# Altium project BAS_DevKITV3.PrjPcb (part 1 of 2)
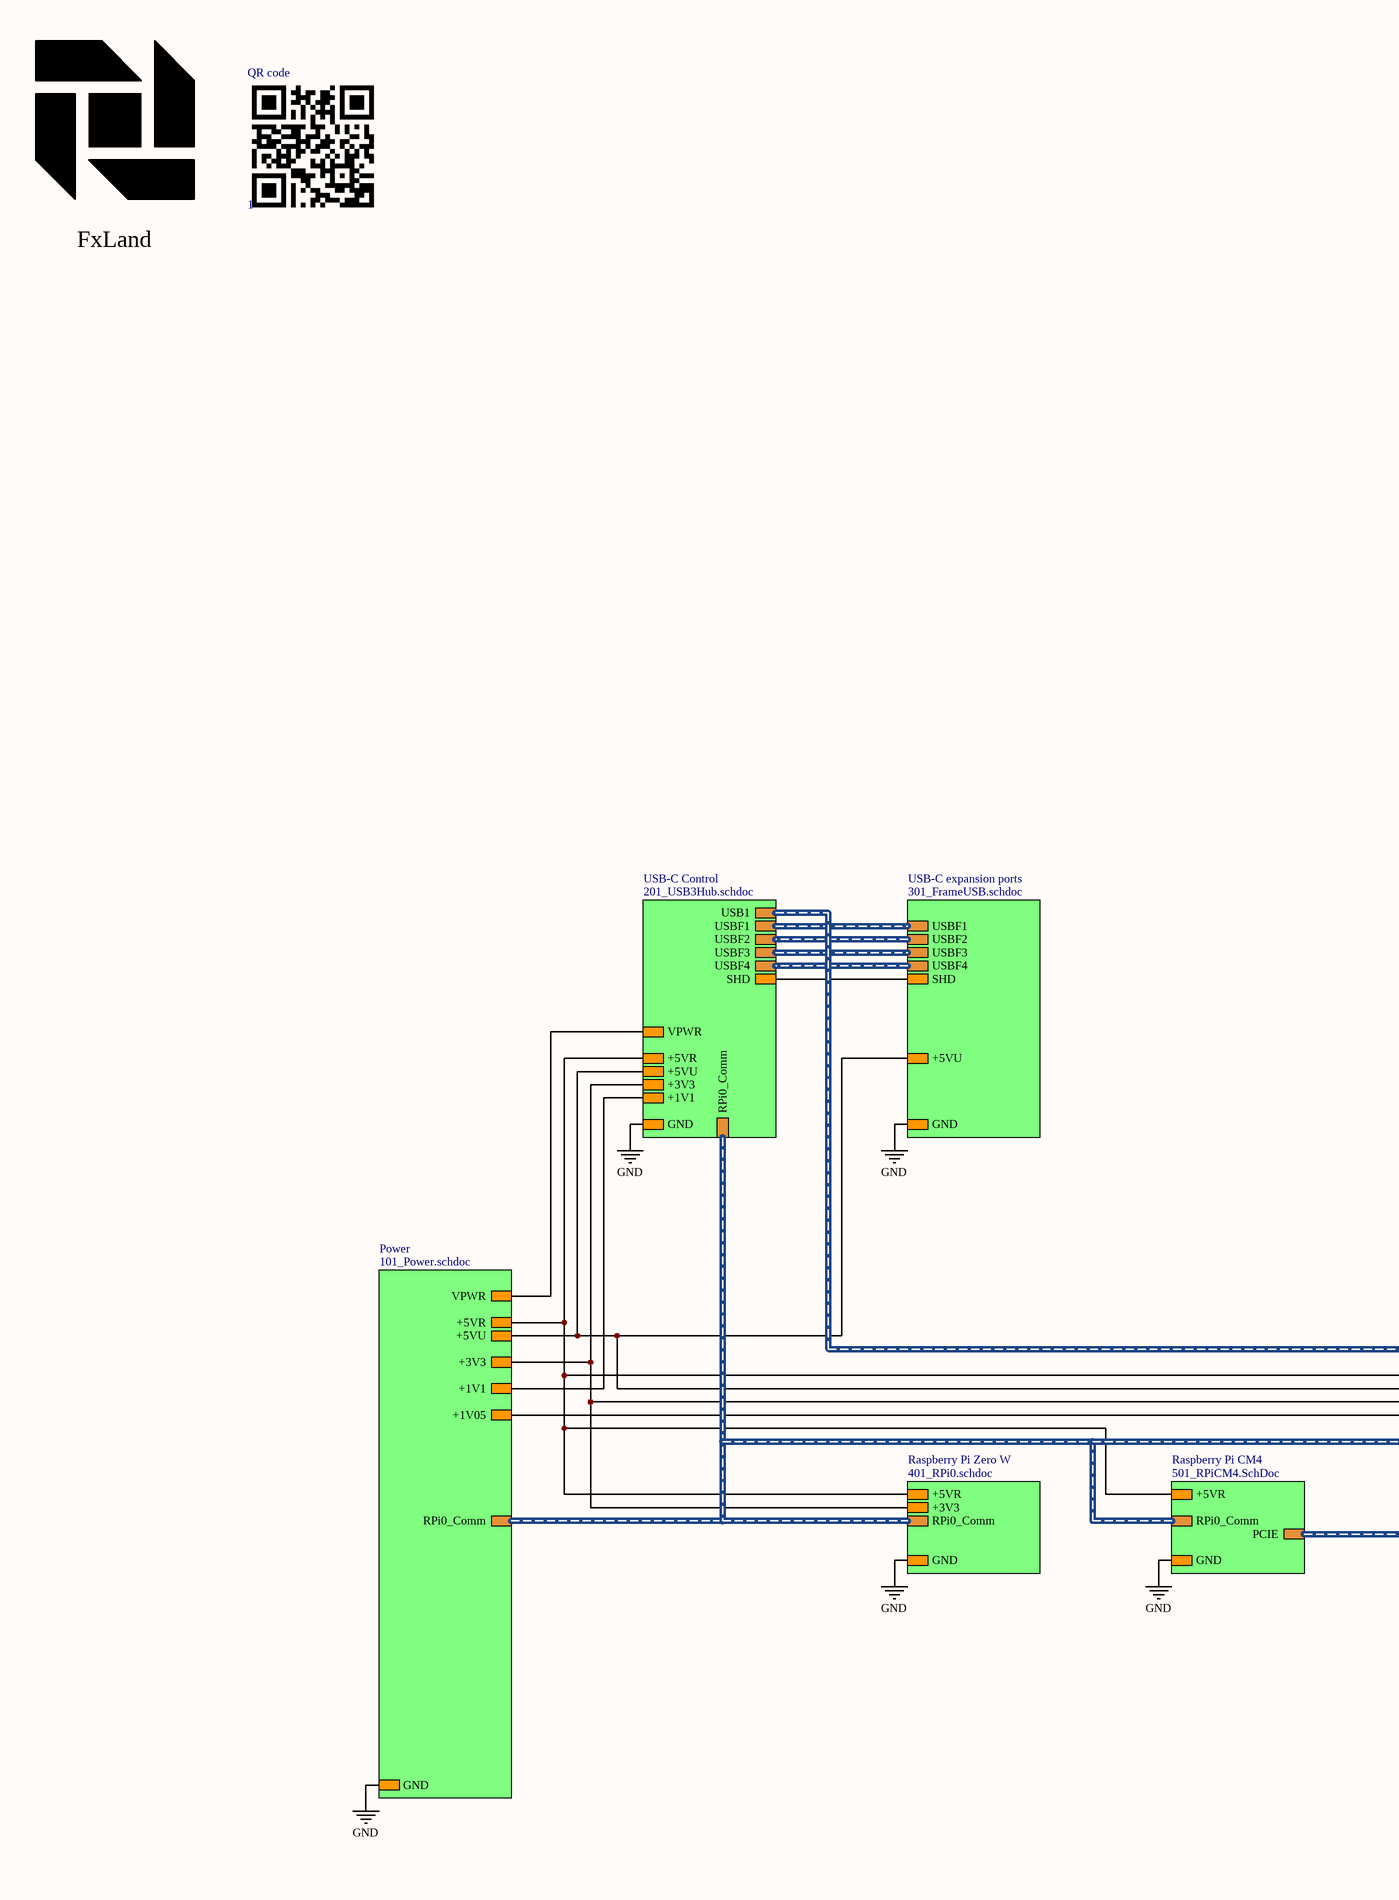
[diagram p0: 001_OverViewDevKIT.SchDoc, left]
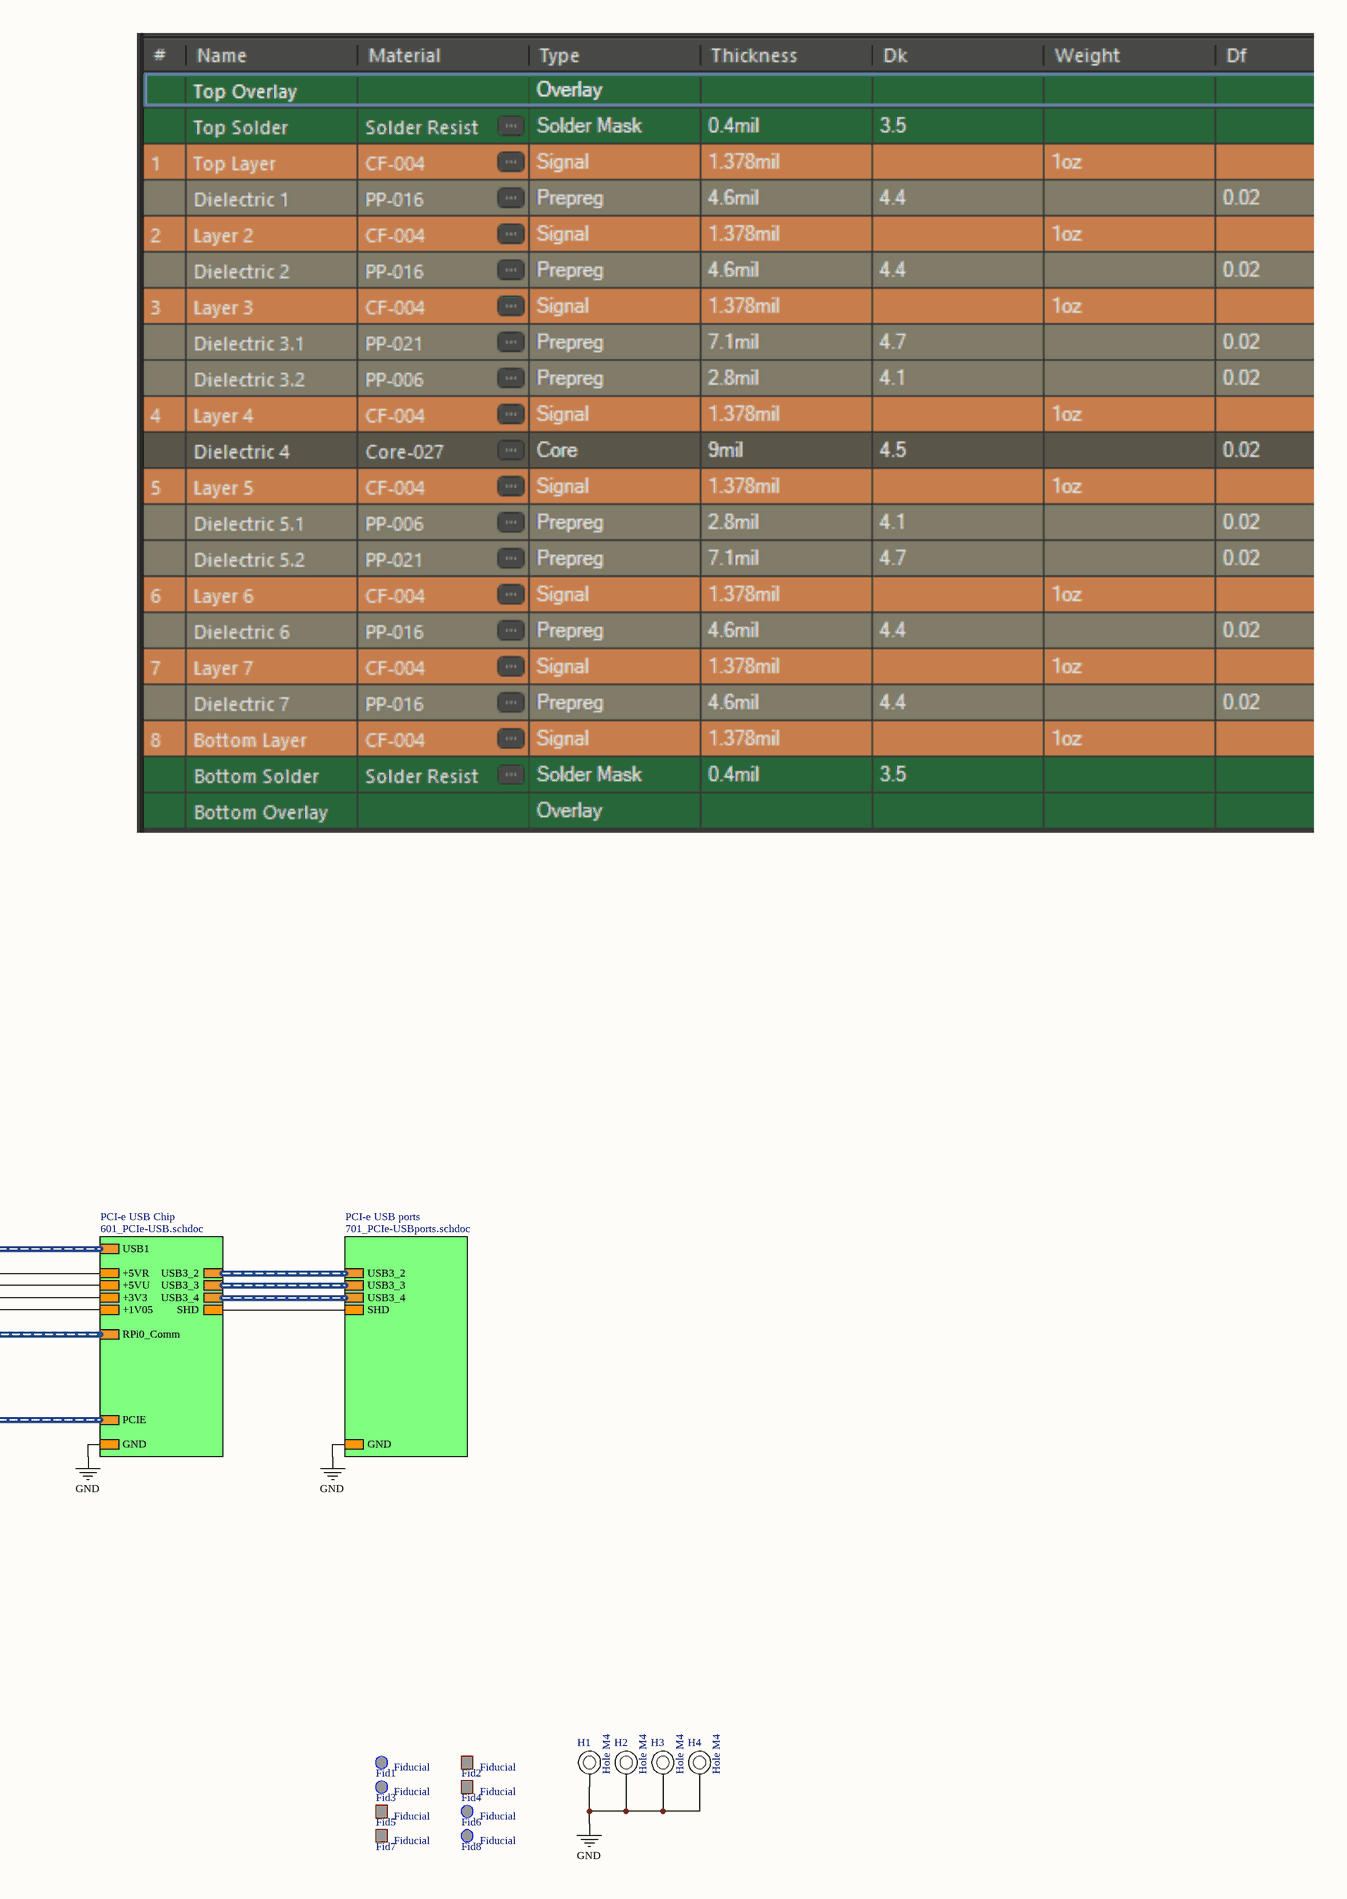
[diagram p1: 001_OverViewDevKIT.SchDoc, right]
Rev: 3.0; DocNumber: P234
8 sheets, 438 parts. Net scope: strictly hierarchical (ports join the sheet entries above them; power ports are local).
Board file: DevKITV3.PcbDoc
Sheets:
  001_OverViewDevKIT.SchDoc
    Power = 101_Power.SchDoc
    USB-C expansion ports = 301_FrameUSB.SchDoc
    Raspberry Pi Zero W = 401_RPi0.SchDoc
    Raspberry Pi CM4 = 501_RPiCM4.SchDoc
    USB-C Control = 201_USB3Hub.SchDoc
    PCI-e USB Chip = 601_PCIe-USB.SchDoc
    PCI-e USB ports = 701_PCIe-USBports.SchDoc

## Sheet 001_OverViewDevKIT.SchDoc: OverView BAS DevKIT
size A2; Organization: Greenfield Tech Solutions; Address1: Molendreef 33; Address2: Ossendrecht; Address3: 4641CS; Address4: The Netherlands; DocumentNumber: P234; Revision: 3.0; SheetNumber: 1; SheetTotal: 8

### Parts
1  QR code  [QR_FXLAND_1]
Fid1  Fiducial  [FidR_1.0mm]
Fid2  Fiducial  [FidS_1.0mm]
Fid3  Fiducial  [FidR_1.0mm]
Fid4  Fiducial  [FidS_1.0mm]
Fid5  Fiducial  [FidS_1.0mm]
Fid6  Fiducial  [FidR_1.0mm]
Fid7  Fiducial  [FidS_1.0mm]
Fid8  Fiducial  [FidR_1.0mm]
H1  Hole M4  [HOLE_M4]
H2  Hole M4  [HOLE_M4]
H3  Hole M4  [HOLE_M4]
H4  Hole M4  [HOLE_M4]
Logo_FxLand1  FxLand  [Logo_FxLand_3]  (value not drawn)

### Sub-sheets
PCI-e USB Chip = 601_PCIe-USB.schdoc: GND, SHD, PCIE (harness HF0), USB1 (harness HF0), +1V05, +3V3, USB3_2 (harness HF1), USB3_3 (harness HF2), USB3_4 (harness HF2), +5VR, +5VU, RPi0_Comm (harness CU1)
PCI-e USB ports = 701_PCIe-USBports.schdoc: GND, SHD, USB3_2 (harness HF1), USB3_3 (harness HF2), USB3_4 (harness HF2)
Power = 101_Power.schdoc: GND, VPWR, +3V3, +1V05, +5VR, RPi0_Comm (harness CU1), +5VU, +1V1
Raspberry Pi CM4 = 501_RPiCM4.SchDoc: GND, +5VR, PCIE (harness HF0), RPi0_Comm (harness CU1)
Raspberry Pi Zero W = 401_RPi0.schdoc: GND, +5VR, +3V3, RPi0_Comm (harness CU1)
USB-C Control = 201_USB3Hub.schdoc: GND, VPWR, +5VR, +3V3, +1V1, SHD, RPi0_Comm (harness CU1), USBF2 (harness HF0), USBF3 (harness HF1), USBF4 (harness HF2), USB1 (harness HF0), USBF1 (harness HF0), +5VU
USB-C expansion ports = 301_FrameUSB.schdoc: GND, +5VU, SHD, USBF2 (harness HF0), USBF3 (harness HF1), USBF4 (harness HF2), USBF1 (harness HF0)

### Nets
+1V1: sheet Power/+1V1, sheet USB-C Control/+1V1
+1V05: sheet Power/+1V05, sheet PCI-e USB Chip/+1V05
+3V3: sheet Power/+3V3, sheet Raspberry Pi Zero W/+3V3, sheet USB-C Control/+3V3, sheet PCI-e USB Chip/+3V3
+5VR: sheet Power/+5VR, sheet Raspberry Pi Zero W/+5VR, sheet Raspberry Pi CM4/+5VR, sheet USB-C Control/+5VR, sheet PCI-e USB Chip/+5VR
+5VU: sheet Power/+5VU, sheet USB-C expansion ports/+5VU, sheet USB-C Control/+5VU, sheet PCI-e USB Chip/+5VU
GND: H1.1 H2.1 H3.1 H4.1 ; sheet Power/GND, sheet USB-C expansion ports/GND, sheet USB-C expansion ports/SHD, sheet Raspberry Pi Zero W/GND, sheet Raspberry Pi CM4/GND, sheet USB-C Control/GND, sheet USB-C Control/SHD, sheet PCI-e USB Chip/GND, sheet PCI-e USB Chip/SHD, sheet PCI-e USB ports/GND, sheet PCI-e USB ports/SHD
VPWR: sheet Power/VPWR, sheet USB-C Control/VPWR

### Buses and harness runs
harness sheet PCI-e USB Chip/PCIE = sheet Raspberry Pi CM4/PCIE
harness sheet PCI-e USB Chip/RPi0_Comm = sheet Power/RPi0_Comm = sheet Raspberry Pi CM4/RPi0_Comm = sheet Raspberry Pi Zero W/RPi0_Comm = sheet USB-C Control/RPi0_Comm
harness sheet PCI-e USB Chip/USB1 = sheet USB-C Control/USB1
harness sheet PCI-e USB Chip/USB3_2 = sheet PCI-e USB ports/USB3_2
harness sheet PCI-e USB Chip/USB3_3 = sheet PCI-e USB ports/USB3_3
harness sheet PCI-e USB Chip/USB3_4 = sheet PCI-e USB ports/USB3_4
harness sheet USB-C Control/USBF1 = sheet USB-C expansion ports/USBF1
harness sheet USB-C Control/USBF2 = sheet USB-C expansion ports/USBF2
harness sheet USB-C Control/USBF3 = sheet USB-C expansion ports/USBF3
harness sheet USB-C Control/USBF4 = sheet USB-C expansion ports/USBF4

### Notes on the sheet
- Title
- Size:
- Date:
- File:
- A2
- Number:
- Time:
- Revision:
- Sheet
- of

### Library data of the parts
1 = ME0023: QR code FxLand 1; Part Number: ME0023; ID: 23; RefVal: QR code
Fid1 Fid3 Fid6 Fid8 = ME0011: Fiducial Round 1mm; Part Number: ME0011; ID: 11; RefVal: Fiducial
Fid2 Fid4 Fid5 Fid7 = ME0012: Fiducial Sqaure 1mm; Part Number: ME0012; ID: 12; RefVal: Fiducial
H1-H4 = ME0002: Mounting Hole M4; Part Number: ME0002; ID: 2; RefVal: Hole M4
Logo_FxLand1 = ME0008: Logo FxLand 3; Part Number: ME0008; ID: 8; RefVal: FxLand

## Sheet 101_Power.SchDoc: Power DevKIT
size A2; Organization: Greenfield Tech Solutions; Address1: Molendreef 33; Address2: Ossendrecht; Address3: 4641CS; Address4: The Netherlands; DocumentNumber: P234; Revision: 3.0; SheetNumber: 2; SheetTotal: 8
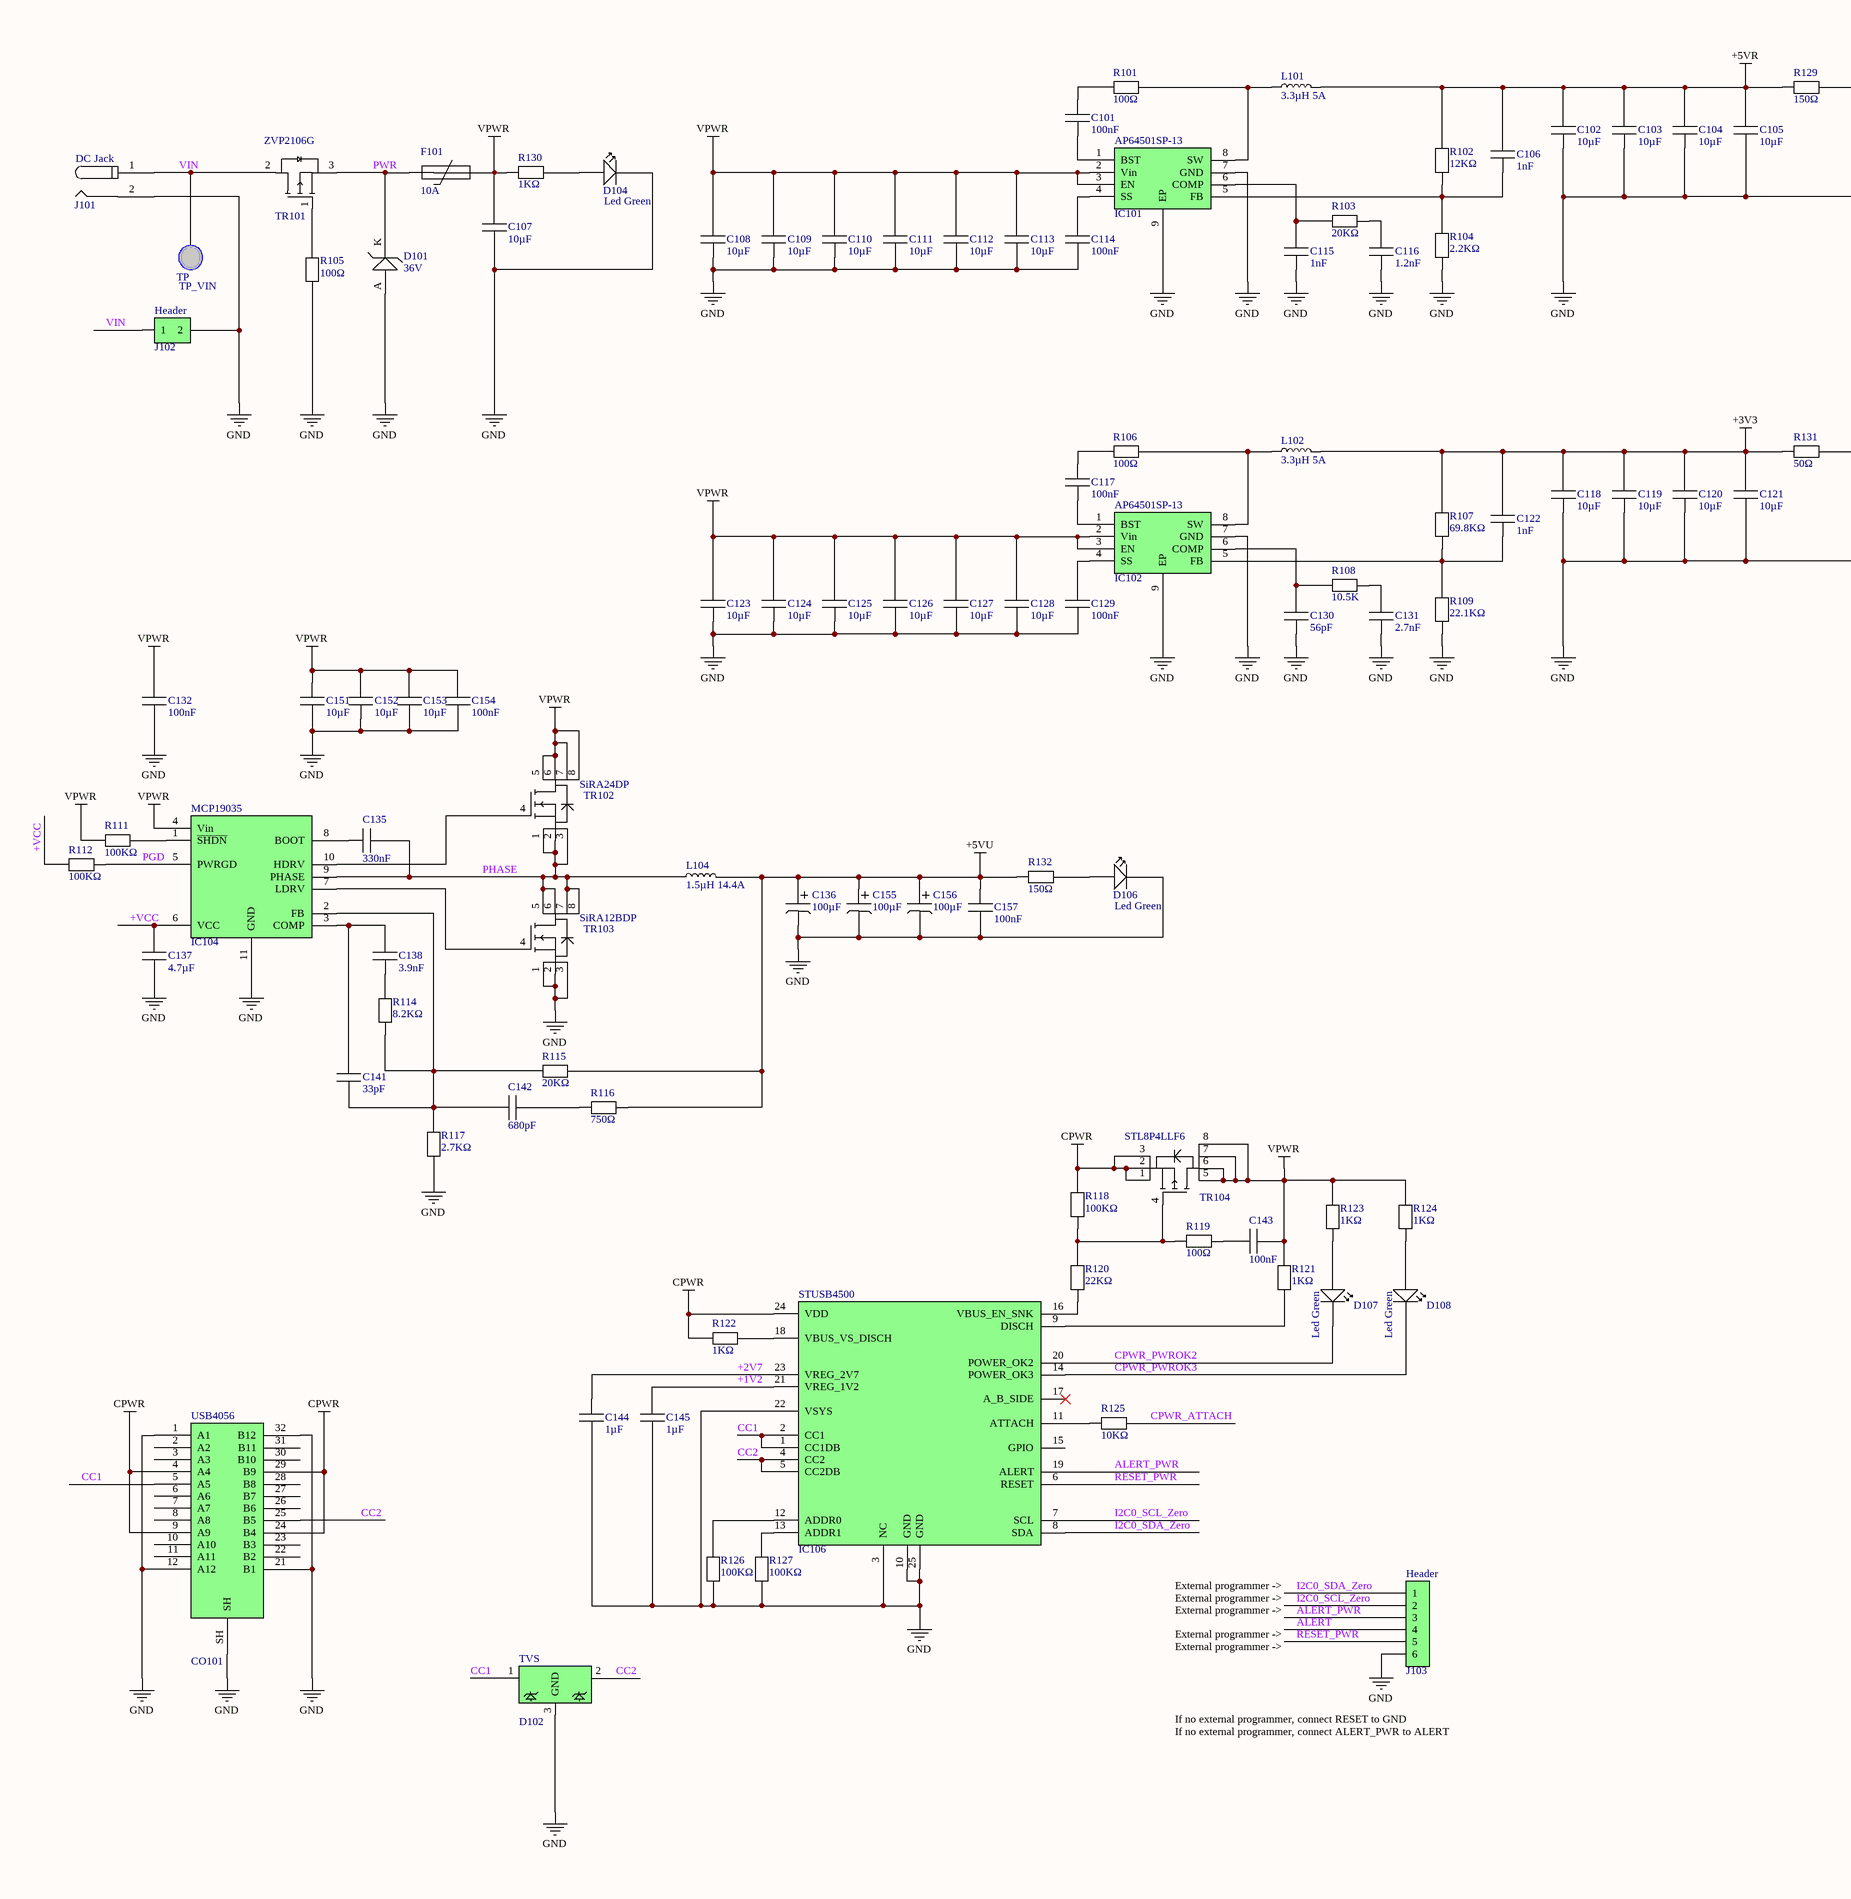
[diagram p2: 101_Power.SchDoc, left]
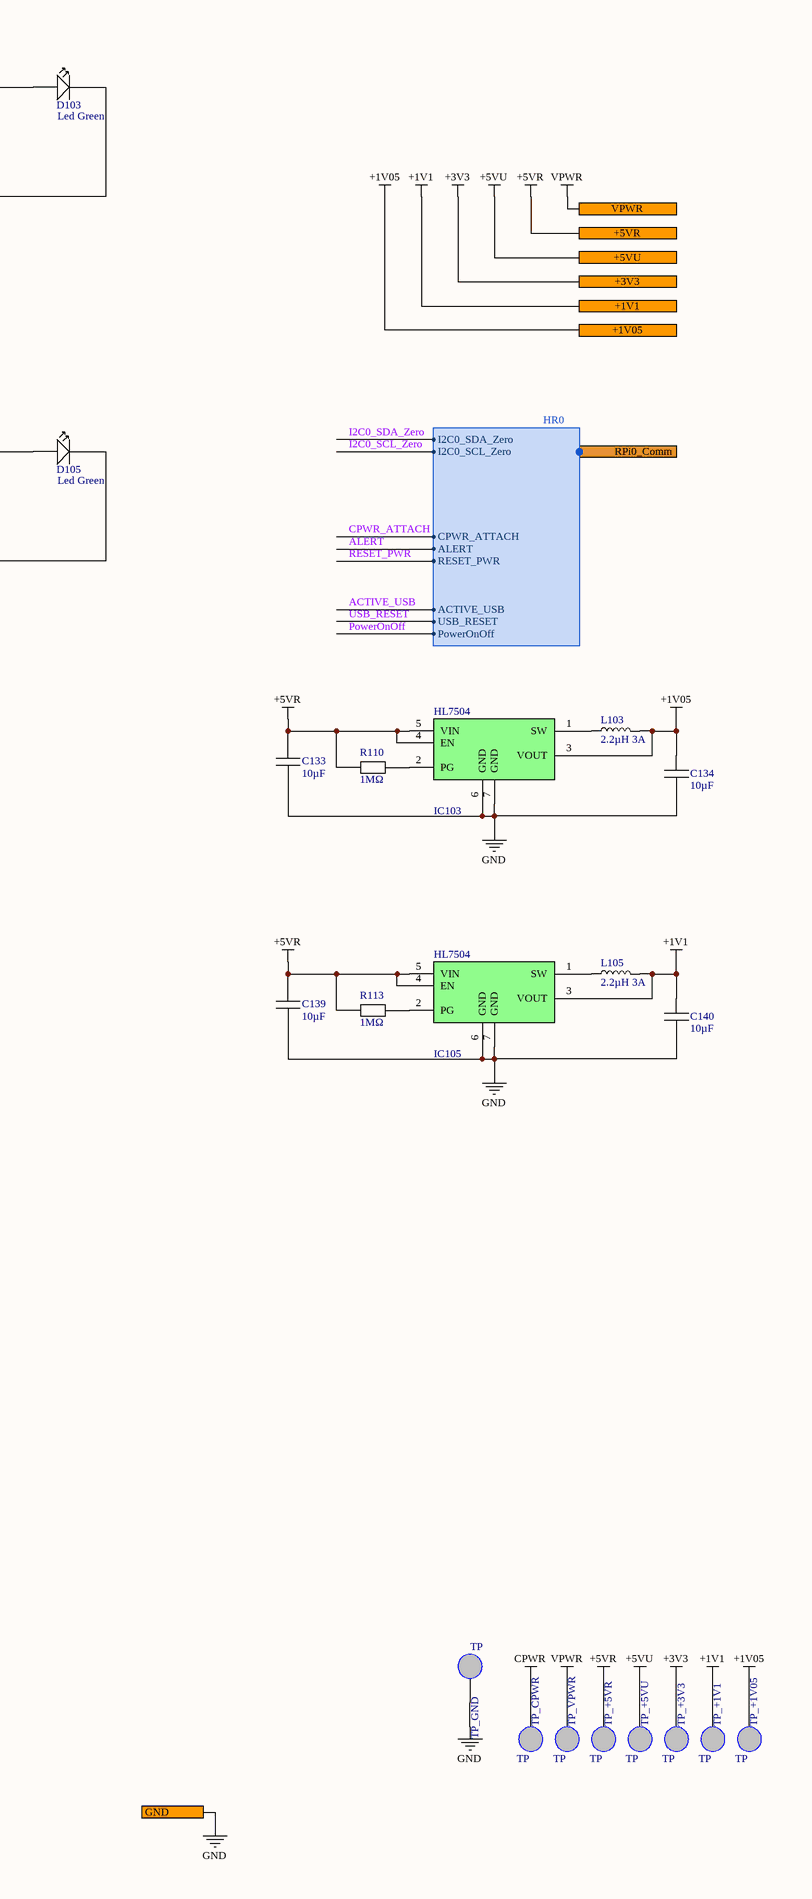
[diagram p3: 101_Power.SchDoc, right]

### Parts
C101  100nF  [C0402]
C102  10µF  [C0805]
C103  10µF  [C0805]
C104  10µF  [C0805]
C105  10µF  [C0805]
C106  1nF  [C0402]
C107  10µF  [C1210]
C108  10µF  [C0805]
C109  10µF  [C0805]
C110  10µF  [C0805]
C111  10µF  [C0805]
C112  10µF  [C0805]
C113  10µF  [C0805]
C114  100nF  [C0402]
C115  1nF  [C0402]
C116  1.2nF  [C0402]
C117  100nF  [C0402]
C118  10µF  [C0805]
C119  10µF  [C0805]
C120  10µF  [C0805]
C121  10µF  [C0805]
C122  1nF  [C0402]
C123  10µF  [C0805]
C124  10µF  [C0805]
C125  10µF  [C0805]
C126  10µF  [C0805]
C127  10µF  [C0805]
C128  10µF  [C0805]
C129  100nF  [C0402]
C130  56pF  [C0402]
C131  2.7nF  [C0402]
C132  100nF  [C0805]
C133  10µF  [C0603]
C134  10µF  [C0603]
C135  330nF  [C0603]
C136  100µF  [RL_6.3_2.5_11]
C137  4.7µF  [C0603]
C138  3.9nF  [C0402]
C139  10µF  [C0603]
C140  10µF  [C0603]
C141  33pF  [C0402]
C142  680pF  [C0402]
C143  100nF  [C0402]
C144  1µF  [C0603]
C145  1µF  [C0603]
C151  10µF  [C1210]
C152  10µF  [C1210]
C153  10µF  [C1210]
C154  100nF  [C0805]
C155  100µF  [RL_6.3_2.5_11]
C156  100µF  [RL_6.3_2.5_11]
C157  100nF  [C0805]
CO101  USB4056  [USB4056-03-A]
D101  36V  [SOD-323]
D102  TVS  [SOT-323]
D103  Led Green  [Led0805]
D104  Led Green  [Led0805]
D105  Led Green  [Led0805]
D106  Led Green  [Led0805]
D107  Led Green  [Led0805]
D108  Led Green  [Led0805]
F101  10A  [F1206]
IC101  AP64501SP-13  [SO-8-EP]
IC102  AP64501SP-13  [SO-8-EP]
IC103  HL7504  [DFN-6G_2X2]
IC104  MCP19035  [DFN-10G_3X3]
IC105  HL7504  [DFN-6G_2X2]
IC106  STUSB4500  [QFN-24G_4X4]
J101  DC Jack  [PJ-082BH]
J102  Header  [1X2P_2.54mm]
J103  Header  [1X6P_2.54MM_SMT]
L101  3.3µH 5A  [SRN6045TA]
L102  3.3µH 5A  [SRN6045TA]
L103  2.2µH 3A  [NRS4018]
L104  1.5µH 14.4A  [0630CDMCDDS]
L105  2.2µH 3A  [NRS4018]
R101  100Ω  [R0603]
R102  12KΩ  [R0402]
R103  20KΩ  [R0402]
R104  2.2KΩ  [R0402]
R105  100Ω  [R0603]
R106  100Ω  [R0603]
R107  69.8KΩ  [R0603]
R108  10.5K  [R0402]
R109  22.1KΩ  [R0603]
R110  1MΩ  [R0402]
R111  100KΩ  [R0402]
R112  100KΩ  [R0402]
R113  1MΩ  [R0402]
R114  8.2KΩ  [R0402]
R115  20KΩ  [R0402]
R116  750Ω  [R0402]
R117  2.7KΩ  [R0402]
R118  100KΩ  [R0402]
R119  100Ω  [R0603]
R120  22KΩ  [R0402]
R121  1KΩ  [R0603]
R122  1KΩ  [R0603]
R123  1KΩ  [R0402]
R124  1KΩ  [R0402]
R125  10KΩ  [R0402]
R126  100KΩ  [R0402]
R127  100KΩ  [R0402]
R129  150Ω  [R0603]
R130  1KΩ  [R0603]
R131  50Ω  [R0603]
R132  150Ω  [R0603]
TP_+1V1  TP  [TP_1MM]
TP_+1V05  TP  [TP_1MM]
TP_+3V3  TP  [TP_1MM]
TP_+5VR  TP  [TP_1MM]
TP_+5VU  TP  [TP_1MM]
TP_CPWR  TP  [TP_1MM]
TP_GND  TP  [TP_1MM]
TP_VIN  TP  [TP_1MM]
TP_VPWR  TP  [TP_1MM]
TR101  ZVP2106G  [SOT-223]
TR102  SiRA24DP  [PowerPAK-SO-8_5X6]
TR103  SiRA12BDP  [PowerPAK-SO-8_5X6]
TR104  STL8P4LLF6  [PowerFLAT-3.3x3.3-8]

### Ports
+1V1, +1V05, +3V3, +5VR, +5VU, GND, RPi0_Comm (harness HR0), VPWR

### Harnesses
HR0: I2C0_SCL_Zero, I2C0_SDA_Zero, CPWR_ATTACH, PowerOnOff, USB_RESET, ACTIVE_USB, ALERT, RESET_PWR

### Nets
+1V1: C140.1 IC105.3(VOUT) L105.2 TP_+1V1.1 ; port +1V1
+1V05: C134.1 IC103.3(VOUT) L103.2 TP_+1V05.1 ; port +1V05
+3V3: C118.1 C119.1 C120.1 C121.1 C122.1 L102.2 R107.2 R131.1 TP_+3V3.1 ; port +3V3
+5VR: C102.1 C103.1 C104.1 C105.1 C106.1 C133.1 C139.1 IC103.4(EN) IC103.5(VIN) IC105.4(EN) IC105.5(VIN) L101.2 R102.2 R110.1 R113.1 R129.1 TP_+5VR.1 ; port +5VR
+5VU: C136.1 C155.1 C156.1 C157.1 L104.2 R115.2 R116.2 R132.1 TP_+5VU.1 ; port +5VU
CPWR: CO101.4(A4) CO101.9(A9) CO101.24(B4) CO101.29(B9) IC106.24(VDD) R118.2 R122.1 TP_CPWR.1 TR104.1(S) TR104.2(S) TR104.3(S)
GND: C102.2 C103.2 C104.2 C105.2 C107.2 C108.2 C109.2 C110.2 C111.2 C112.2 C113.2 C114.2 C115.2 C116.2 C118.2 C119.2 C120.2 C121.2 C123.2 C124.2 C125.2 C126.2 C127.2 C128.2 C129.2 C130.2 C131.2 C132.2 C133.2 C134.2 C136.2 C137.2 C139.2 C140.2 C144.2 C145.2 C151.2 C152.2 C153.2 C154.2 C155.2 C156.2 C157.2 CO101.1(A1) CO101.12(A12) CO101.21(B1) CO101.32(B12) CO101.SH D101.A D102.3(GND) D103.K D104.K D105.K D106.K IC101.7(GND) IC101.9(EP) IC102.7(GND) IC102.9(EP) IC103.6(GND) IC103.7(GND) IC104.11(GND) IC105.6(GND) IC105.7(GND) IC106.3(NC) IC106.10(GND) IC106.22(VSYS) IC106.25(GND) J101.2 J102.2 J103.6 R104.1 R105.1 R109.1 R117.1 R126.1 R127.1 TP_GND.1 TR103.1(S) TR103.2(S) TR103.3(S) ; port GND
VPWR: C107.1 C108.1 C109.1 C110.1 C111.1 C112.1 C113.1 C123.1 C124.1 C125.1 C126.1 C127.1 C128.1 C132.1 C143.2 C151.1 C152.1 C153.1 C154.1 F101.2 IC101.2(Vin) IC101.3(EN) IC102.2(Vin) IC102.3(EN) IC104.4(Vin) R111.1 R121.2 R123.2 R124.2 R130.1 TP_VPWR.1 TR102.5(D) TR102.6(D) TR102.7(D) TR102.8(D) TR104.5(D) TR104.6(D) TR104.7(D) TR104.8(D) ; port VPWR
+1V2: C145.1 IC106.21(VREG_1V2)
+2V7: C144.1 IC106.23(VREG_2V7)
+VCC: C137.1 IC104.6(VCC) R112.1
ALERT: J103.4 ; port RPi0_Comm.ALERT
ALERT_PWR: IC106.19(ALERT) J103.3
CC1: CO101.5(A5) D102.1 IC106.1(CC1DB) IC106.2(CC1)
CC2: CO101.25(B5) D102.2 IC106.4(CC2) IC106.5(CC2DB)
CPWR_ATTACH: R125.2 ; port RPi0_Comm.CPWR_ATTACH
CPWR_PWROK2: D107.K IC106.20(POWER_OK2)
CPWR_PWROK3: D108.K IC106.14(POWER_OK3)
I2C0_SCL_Zero: IC106.7(SCL) J103.2 ; port RPi0_Comm.I2C0_SCL_Zero
I2C0_SDA_Zero: IC106.8(SDA) J103.1 ; port RPi0_Comm.I2C0_SDA_Zero
PGD: IC104.5(PWRGD) R112.2
PHASE: C135.2 IC104.9(PHASE) L104.1 TR102.1(S) TR102.2(S) TR102.3(S) TR103.5(D) TR103.6(D) TR103.7(D) TR103.8(D)
PowerOnOff: port RPi0_Comm.PowerOnOff
PWR: D101.K F101.1 TR101.3(S)
RESET_PWR: IC106.6(RESET) J103.5 ; port RPi0_Comm.RESET_PWR
VIN: J101.1 J102.1 TP_VIN.1 TR101.2(D)
NetC101_1: C101.1 R101.1
NetC101_2: C101.2 IC101.1(BST)
NetC106_2: C106.2 IC101.5(FB) R102.1 R104.2
NetC114_1: C114.1 IC101.4(SS)
NetC115_1: C115.1 IC101.6(COMP) R103.2
NetC116_1: C116.1 R103.1
NetC117_1: C117.1 R106.1
NetC117_2: C117.2 IC102.1(BST)
NetC122_2: C122.2 IC102.5(FB) R107.1 R109.2
NetC129_1: C129.1 IC102.4(SS)
NetC130_1: C130.1 IC102.6(COMP) R108.2
NetC131_1: C131.1 R108.1
NetC135_1: C135.1 IC104.8(BOOT)
NetC138_1: C138.1 C141.1 IC104.3(COMP)
NetC138_2: C138.2 R114.2
NetC141_2: C141.2 C142.1 IC104.2(FB) R114.1 R115.1 R117.2
NetC142_2: C142.2 R116.1
NetC143_1: C143.1 R119.2
NetD103_A: D103.A R129.2
NetD104_A: D104.A R130.2
NetD105_A: D105.A R131.2
NetD106_A: D106.A R132.2
NetD107_A: D107.A R123.1
NetD108_A: D108.A R124.1
NetIC101_8: IC101.8(SW) L101.1 R101.2
NetIC102_8: IC102.8(SW) L102.1 R106.2
NetIC103_1: IC103.1(SW) L103.1
NetIC103_2: IC103.2(PG) R110.2
NetIC104_1: IC104.1(~{SHDN}) R111.2
NetIC104_7: IC104.7(LDRV) TR103.4(G)
NetIC104_10: IC104.10(HDRV) TR102.4(G)
NetIC105_1: IC105.1(SW) L105.1
NetIC105_2: IC105.2(PG) R113.2
NetIC106_9: IC106.9(DISCH) R121.1
NetIC106_11: IC106.11(ATTACH) R125.1
NetIC106_12: IC106.12(ADDR0) R126.2
NetIC106_13: IC106.13(ADDR1) R127.2
NetIC106_16: IC106.16(VBUS_EN_SNK) R120.1
NetIC106_18: IC106.18(VBUS_VS_DISCH) R122.2
NetR105_2: R105.2 TR101.1(G)
NetR118_1: R118.1 R119.1 R120.2 TR104.4(G)

Not connected (* = marked no-connect by the designer): CO101 2(A2) 3(A3) 6(A6) 7(A7) 8(A8) 10(A10) 11(A11) 22(B2) 23(B3) 26(B6) 27(B7) 28(B8) 30(B10) 31(B11); IC106 15(GPIO) 17(A_B_SIDE)*

### Notes on the sheet
- External programmer ->
- If no external programmer, connect RESET to GND
- If no external programmer, connect ALERT_PWR to ALERT
- Title
- Size:
- Date:
- File:
- A2
- Number:
- Time:
- Revision:
- Sheet
- of

### Library data of the parts
C101 C114 C117 C129 C143 = CA0029: 100nF 50V 10% X7R; Part Number: CA0029; ManfactPart: CGA2B3X7R1H104K050BB; ID: 29; RefVal: 100nF
C102-C105 C118-C121 = CA0001: 10µF 16V 10% X5R; Part Number: CA0001; ManfactPart: GRM21BR61C106KE15L; ID: 1; RefVal: 10µF
C106 C115 C122 = CA0031: 1nF 50V 1% C0G; Part Number: CA0031; ManfactPart: GRT1555C1H102FA02D; ID: 31; RefVal: 1nF
C107 C151-C153 = CA0024: 10µF 63V 10% X7R; Part Number: CA0024; ManfactPart: GRM32ER71J106KA12; ID: 24; RefVal: 10µF
C108-C113 C123-C128 = CA0005: 10µF 35V 10% X5R; Part Number: CA0005; ManfactPart: C2012X5R1V106K125AC; ID: 5; RefVal: 10µF
C116 = CA0030: 1.2nF 50V 10% X7R; Part Number: CA0030; ManfactPart: GCM155R71H122KA37D; ID: 30; RefVal: 1.2nF
C130 = CA0068: 56pF 50V 2% C0G; Part Number: CA0068; ManfactPart: CC0402GRNPO9BN560; ID: 68; RefVal: 56pF
C131 = CA0055: 2.7nF 50V 5% X7R; Part Number: CA0055; ManfactPart: GRM155R71H272JA01D; ID: 55; RefVal: 2.7nF
C132 C154 C157 = CA0023: 100nF 50V 20% X7R; Part Number: CA0023; ManfactPart: C0805C104M5RAC; ID: 23; RefVal: 100nF
C133 C134 C139 C140 = CA0008: 10µF 16V 20% X5R; Part Number: CA0008; ManfactPart: GRM188R61C106MAALD; ID: 8; RefVal: 10µF
C135 = CA0004: 330nF 35V 10% X5R; Part Number: CA0004; ManfactPart: CGA3E3X5R1V334K080AB; ID: 4; RefVal: 330nF
C136 C155 C156 = CA0050: 100µF 35V 20% 231mA; Part Number: CA0050; ManfactPart: 860010573007; ID: 50; RefVal: 100µF
C137 = CA0002: 4.7µF 16V 10% X5R; Part Number: CA0002; ManfactPart: C1608X5R1C475K080AC; ID: 2; RefVal: 4.7µF
C138 = CA0066: 3.9nF 50V 10% X7R; Part Number: CA0066; ManfactPart: GCM155R71H392KA37D; ID: 66; RefVal: 3.9nF
C141 = CA0067: 33pF 50V 5% C0G; Part Number: CA0067; ManfactPart: C1005C0G1H330J050BA; ID: 67; RefVal: 33pF
C142 = CA0065: 680pF 50V 10% X7R; Part Number: CA0065; ManfactPart: C0402C681K5RAC; ID: 65; RefVal: 680pF
C144 C145 = CA0003: 1µF 16V 10% X5R; Part Number: CA0003; ManfactPart: C1608X5R1C105K080AA; ID: 3; RefVal: 1µF
CO101 = CO0030: USB C connector Receptacle Horizontal; Part Number: CO0030; ID: 29; RefVal: USB4056; ManfactPart: USB4056-03-A
D101 = DI0008: Zener Diode 36V 200mW; Part Number: DI0008; ManfactPart: BZT52C36S; ID: 8; RefVal: 36V
D102 = DI0009: TRANSIL array for data protection; Part Number: DI0009; ManfactPart: ESDA25W; ID: 9; RefVal: TVS
D103-D108 = DI0001: Part Number: DI0001; ManfactPart: KP-2012CGCK; ID: 1; RefVal: Led Green
F101 = F0004: 32V/10A; Part Number: F0004; ManfactPart: C1H10; ID: 4; RefVal: 10A
IC101 IC102 = IC0031: 3.8V TO 40V INPUT, 5A LOW IQ SYNCHRONOUS BUCK WITH PROGRAMMABLE SOFT-START TIME; Part Number: IC0031; ID: 31; RefVal: AP64501SP-13; ManfactPart: AP64501SP-13
IC103 = IC0049: 3MHz 2A Buck Converter 1.05V OUT; Part Number: IC0049; ManfactPart: HL7504FN04; ID: 49; RefVal: HL7504
IC104 = IC0055: Switching Controllers Synchronous Buck PWM Control 600kHz 12ns; Part Number: IC0055; ManfactPart: MCP19035-BAABE/MF; ID: 55; RefVal: MCP19035
IC105 = IC0050: 3MHz 2A Buck Converter 1.10V OUT; Part Number: IC0050; ManfactPart: HL7504FN08; ID: 50; RefVal: HL7504
IC106 = IC0057: USB Interface IC Standalone USB PD controller for power sinking devices; Part Number: IC0057; ManfactPart: STUSB4500QTR; ID: 57; RefVal: STUSB4500
J101 = CO0015: DC Jack 36V @10A; Part Number: CO0015; ID: 22; RefVal: DC Jack; ManfactPart: PJ-082BH
J102 = CO0012: Header 1x2P; Part Number: CO0012; ManfactPart: G800W306018EU; ID: 12; RefVal: Header
J103 = CO0043: Header 1x6P SMT Mount; Part Number: CO0043; ManfactPart: G800MJ302018EU; ID: 43; RefVal: Header
L101 L102 = IN0005: 3.3µH 5A 30% 21mΩ; Part Number: IN0005; ManfactPart: SRN6045TA-3R3Y; ID: 5; RefVal: 3.3µH 5A
L103 L105 = IN0004: Part Number: IN0004; ManfactPart: NRS4018T2R2MDGJ; ID: 4; RefVal: 2.2µH 3A
L104 = IN0017: 1.5µH 14.4A 20% 7.4mΩ; Part Number: IN0017; ManfactPart: 0630CDMCDDS-1R0MC; ID: 17; RefVal: 1.5µH 14.4A
R101 R105 R106 R119 = RS0007: 100Ω 1% 100mW; Part Number: RS0007; ManfactPart: WR06X1000FTL; ID: 7; RefVal: 100Ω
R102 = RS0015: 12KΩ 1% 62.5mW; Part Number: RS0015; ManfactPart: RC0402FR-1312KL; ID: 15; RefVal: 12KΩ
R103 R115 = RS0034: 20KΩ 1% 100mW 100PPM; Part Number: RS0034; ManfactPart: ERJ-S02F2002X; ID: 34; RefVal: 20KΩ
R104 = RS0035: 2.2KΩ 1% 62.5mW 100PPM; Part Number: RS0035; ManfactPart: CRGCQ0402F2K2; ID: 35; RefVal: 2.2KΩ
R107 = RS0041: 69.8KΩ 1% 100mW 100PPM; Part Number: RS0041; ManfactPart: CRCW060369K8FKEB; ID: 41; RefVal: 69.8KΩ
R108 = RS0054: 10.5KΩ 1% 62.5mW 100PPM; Part Number: RS0054; ManfactPart: CRCW040210K5FKEDC; ID: 54; RefVal: 10.5K
R109 = RS0040: 22.1KΩ 1% 100mW 100PPM; Part Number: RS0040; ManfactPart: RC0603FR-0722K1L; ID: 40; RefVal: 22.1KΩ
R110 R113 = RS0066: 1MΩ 1% 62.5mW 100PPM; Part Number: RS0066; ManfactPart: 0402WGF1004TCE; ID: 66; RefVal: 1MΩ
R111 R112 R118 R126 R127 = RS0036: 100KΩ 1% 62.5mW 100PPM; Part Number: RS0036; ManfactPart: AC0402FR-13100KL; ID: 36; RefVal: 100KΩ
R114 = RS0079: 8.2KΩ 1% 62.5mW 100PPM; Part Number: RS0079; ManfactPart: 0402WGF8201TCE; ID: 79; RefVal: 8.2KΩ
R116 = RS0078: 750Ω 1% 62.5mW 100PPM; Part Number: RS0078; ManfactPart: CRG0402F750R; ID: 78; RefVal: 750Ω
R117 = RS0059: 2.7KΩ 1% 62.5mW 100PPM; Part Number: RS0059; ManfactPart: CRG0402F2K7; ID: 59; RefVal: 2.7KΩ
R120 = RS0033: 22KΩ 1% 62.5mW 100PPM; Part Number: RS0033; ManfactPart: MCWR04X2202FTL; ID: 33; RefVal: 22KΩ
R121 R122 R130 = RS0008: 1KΩ 5% 100mW; Part Number: RS0008; ManfactPart: WR06X102 JTL; ID: 8; RefVal: 1KΩ
R123 R124 = RS0037: 1KΩ 5% 62.5mW 100PPM; Part Number: RS0037; ManfactPart: RC0402JR-131KL; ID: 37; RefVal: 1KΩ
R125 = RS0011: 10KΩ 1% 62.5mW; Part Number: RS0011; ManfactPart: WR04X1002FTL; ID: 11; RefVal: 10KΩ
R129 R132 = RS0001: 150Ω 1% 100mW; Part Number: RS0001; ManfactPart: MCWR06X1500FTL; ID: 1; RefVal: 150Ω
R131 = RS0080: 50Ω 0.1% 100mW 50PPM; Part Number: RS0080; ManfactPart: RT0603BRE0750RL; ID: 80; RefVal: 50Ω
TP_+1V1 TP_+1V05 TP_+3V3 TP_+5VR TP_+5VU TP_CPWR TP_GND TP_VIN TP_VPWR = ME0027: Testpoint 1mm; Part Number: ME0027; ID: 27; RefVal: TP
TR101 = TR0007: 36V-PNP-E; Part Number: TR0007; ManfactPart: ZVP2106GTA; ID: 7; RefVal: ZVP2106G
TR102 = TR0012: 25V/2.4mΩ, N-channel Power MOSFET, 35.6A; Part Number: TR0012; ManfactPart: SIRA24DP-T1-GE3; ID: 12; RefVal: SiRA24DP
TR103 = TR0013: 30V/6mΩ, N-channel Power MOSFET, 22A; Part Number: TR0013; ManfactPart: SIRA12BDP-T1-GE3; ID: 13; RefVal: SiRA12BDP
TR104 = TR0010: 40V/17.5mΩ, P-channel Trench MOSFET, 8A; Part Number: TR0010; ID: 10; RefVal: STL8P4LLF6; ManfactPart: STL8P4LLF6

## Sheet 301_FrameUSB.SchDoc: USB Framework Ports
size A2; Organization: Greenfield Tech Solutions; Address1: Molendreef 33; Address2: Ossendrecht; Address3: 4641CS; Address4: The Netherlands; DocumentNumber: P234; Revision: 3.0; SheetNumber: 4; SheetTotal: 8
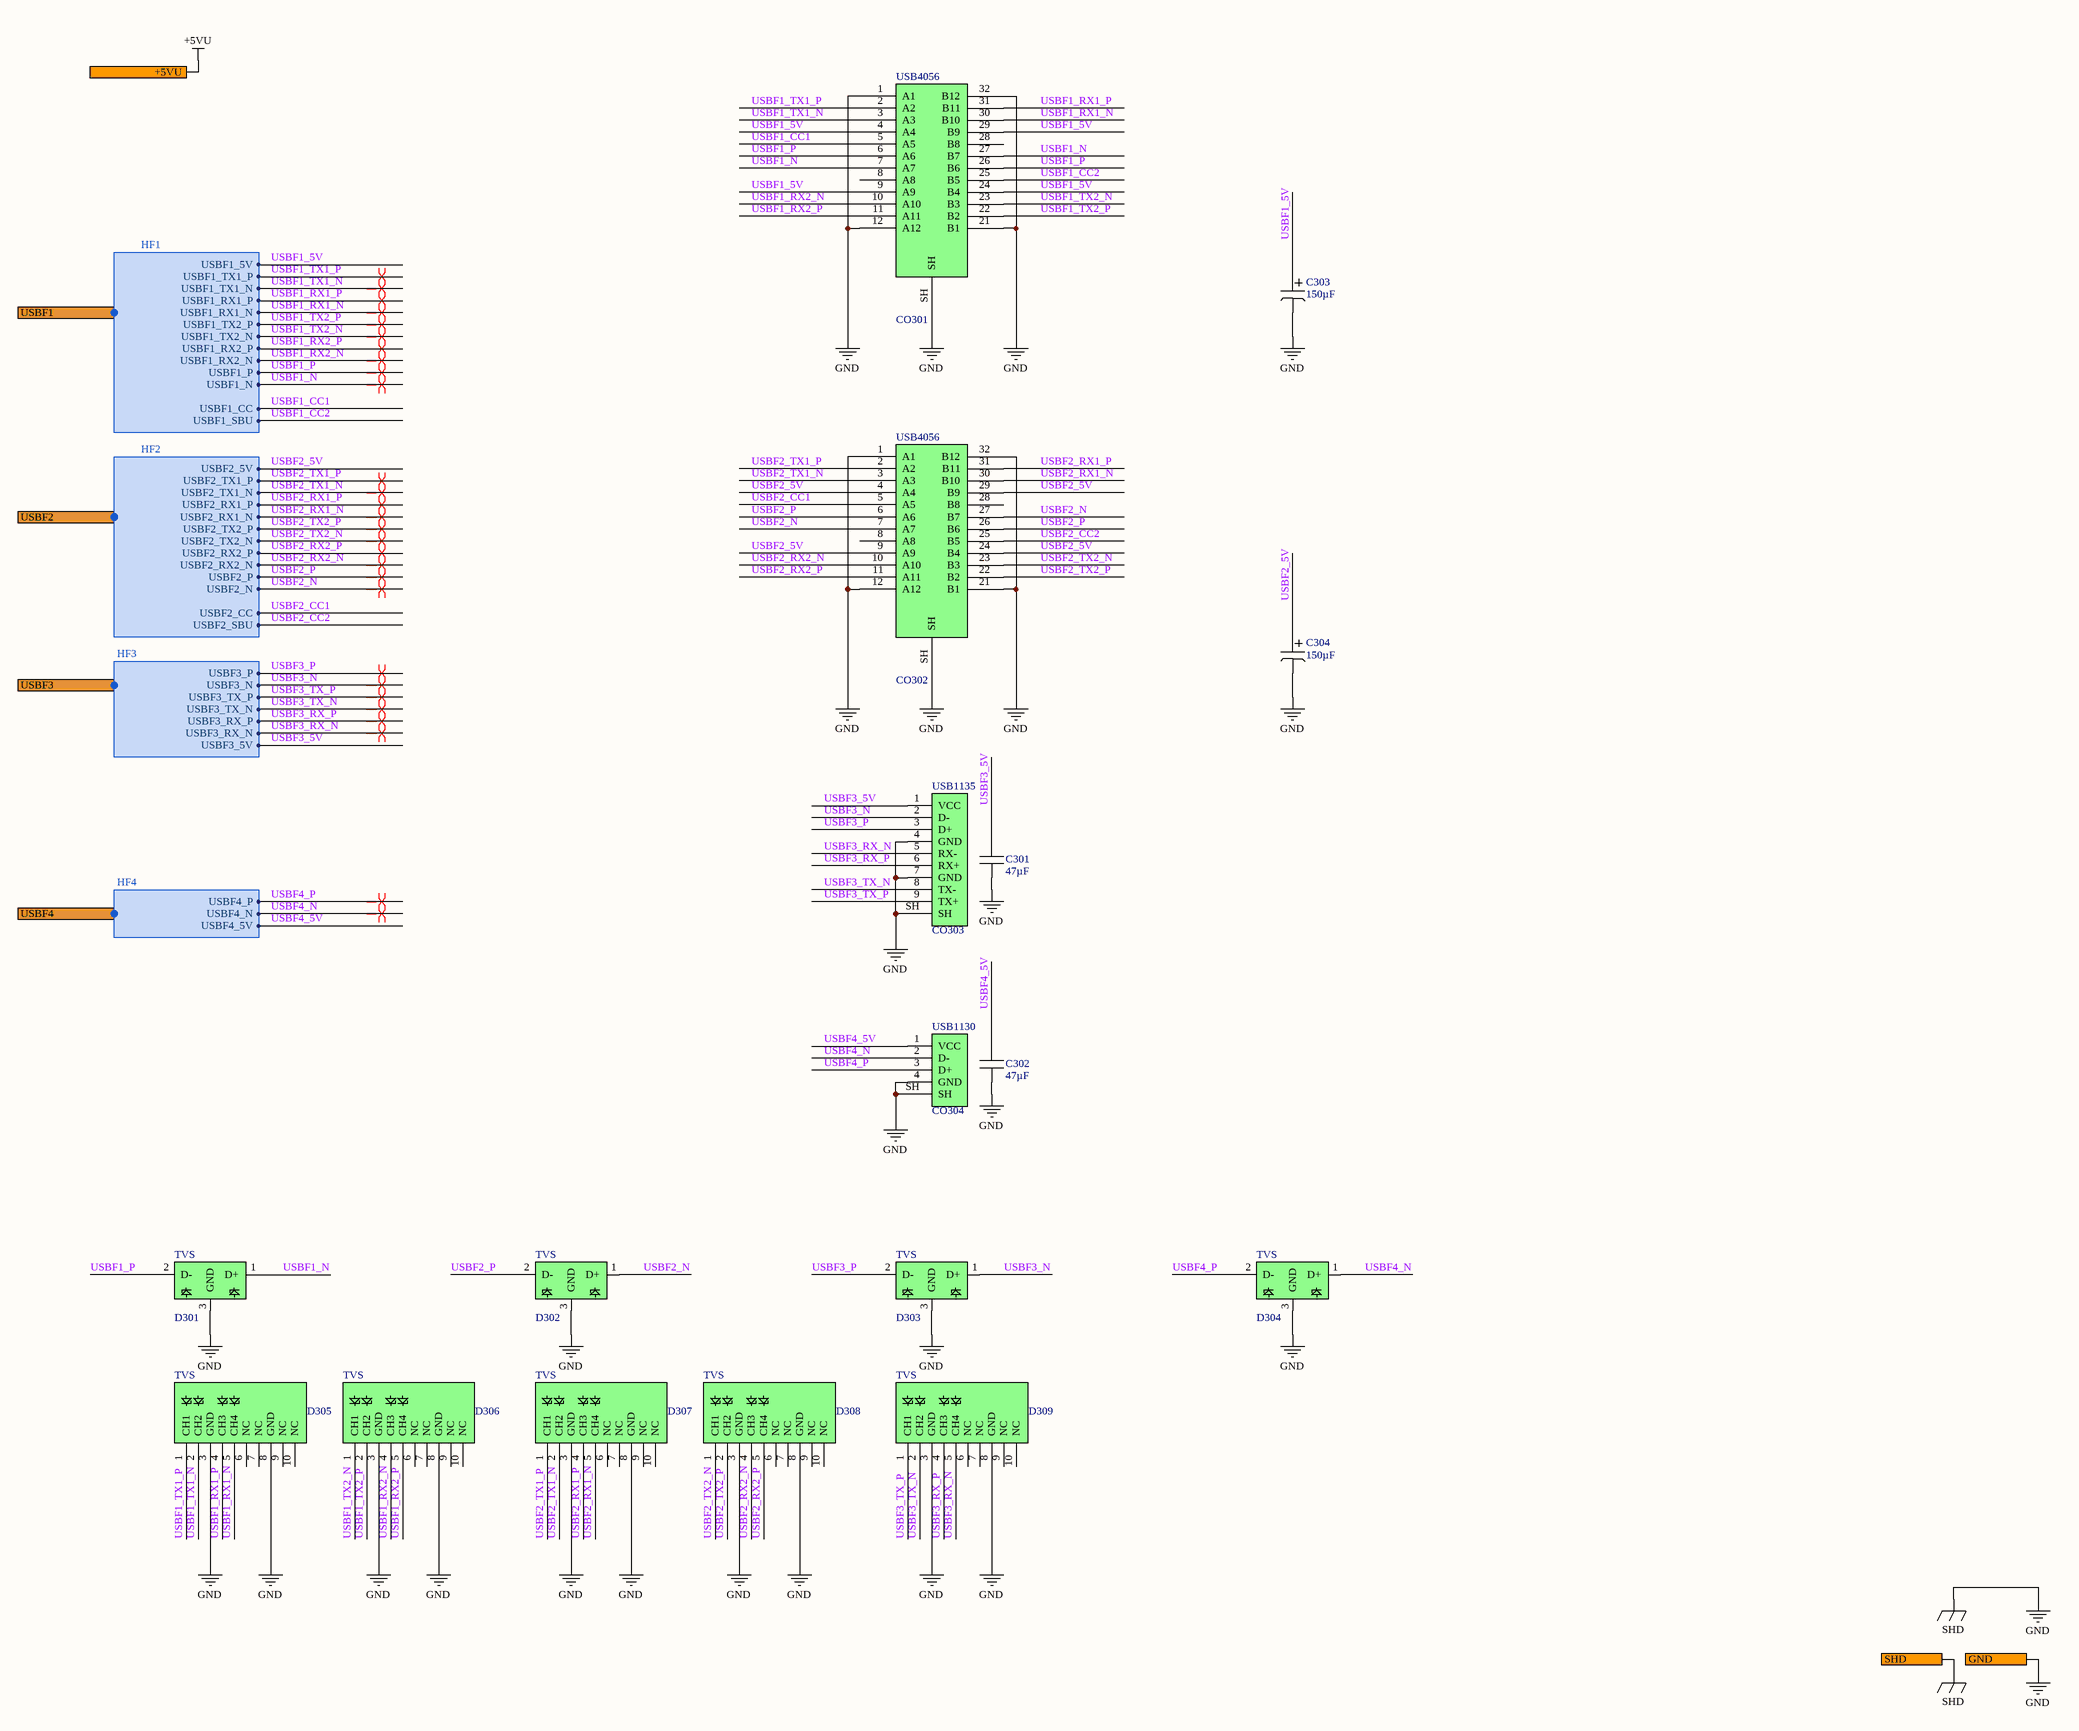
[diagram p4: 301_FrameUSB.SchDoc]

### Parts
C301  47µF  [C1210]
C302  47µF  [C1210]
C303  150µF  [RL_10_5_12.5]
C304  150µF  [RL_10_5_12.5]
CO301  USB4056  [USB4056-03-A]
CO302  USB4056  [USB4056-03-A]
CO303  USB1135  [USB1135-15-9-L-B]
CO304  USB1130  [USB1130-15-A]
D301  TVS  [SOT-3]
D302  TVS  [SOT-3]
D303  TVS  [SOT-3]
D304  TVS  [SOT-3]
D305  TVS  [SOT-1176-1]
D306  TVS  [SOT-1176-1]
D307  TVS  [SOT-1176-1]
D308  TVS  [SOT-1176-1]
D309  TVS  [SOT-1176-1]

### Ports
+5VU, GND, SHD, USBF1 (harness HF1), USBF2 (harness HF2), USBF3 (harness HF3), USBF4 (harness HF4)

### Harnesses
HF1: USBF1_5V, USBF1_TX1_P, USBF1_TX1_N, USBF1_RX1_P, USBF1_RX1_N, USBF1_CC, USBF1_SBU, USBF1_RX2_P, USBF1_RX2_N, USBF1_TX2_P, USBF1_TX2_N, USBF1_N, USBF1_P
HF2: USBF2_5V, USBF2_TX1_P, USBF2_TX1_N, USBF2_RX1_P, USBF2_RX1_N, USBF2_CC, USBF2_SBU, USBF2_RX2_P, USBF2_RX2_N, USBF2_TX2_P, USBF2_TX2_N, USBF2_N, USBF2_P
HF3: USBF3_N, USBF3_P, USBF3_TX_N, USBF3_TX_P, USBF3_RX_N, USBF3_RX_P, USBF3_5V
HF4: USBF4_N, USBF4_P, USBF4_5V

### Nets
GND: C301.2 C302.2 C303.2 C304.2 CO301.1(A1) CO301.12(A12) CO301.21(B1) CO301.32(B12) CO301.SH CO302.1(A1) CO302.12(A12) CO302.21(B1) CO302.32(B12) CO302.SH CO303.4(GND) CO303.7(GND) CO303.SH CO304.4(GND) CO304.SH D301.3(GND) D302.3(GND) D303.3(GND) D304.3(GND) D305.3(GND) D305.8(GND) D306.3(GND) D306.8(GND) D307.3(GND) D307.8(GND) D308.3(GND) D308.8(GND) D309.3(GND) D309.8(GND) ; port GND, port SHD  [also labelled SHD]
USBF1_5V: C303.1 CO301.4(A4) CO301.9(A9) CO301.24(B4) CO301.29(B9) ; port USBF1.USBF1_5V
USBF1_CC1: CO301.5(A5) ; port USBF1.USBF1_CC
USBF1_CC2: CO301.25(B5) ; port USBF1.USBF1_SBU
USBF1_N: CO301.7(A7) CO301.27(B7) D301.1(D+) ; port USBF1.USBF1_N
USBF1_P: CO301.6(A6) CO301.26(B6) D301.2(D-) ; port USBF1.USBF1_P
USBF1_RX1_N: CO301.30(B10) D305.5(CH4) ; port USBF1.USBF1_RX1_N
USBF1_RX1_P: CO301.31(B11) D305.4(CH3) ; port USBF1.USBF1_RX1_P
USBF1_RX2_N: CO301.10(A10) D306.4(CH3) ; port USBF1.USBF1_RX2_N
USBF1_RX2_P: CO301.11(A11) D306.5(CH4) ; port USBF1.USBF1_RX2_P
USBF1_TX1_N: CO301.3(A3) D305.2(CH2) ; port USBF1.USBF1_TX1_N
USBF1_TX1_P: CO301.2(A2) D305.1(CH1) ; port USBF1.USBF1_TX1_P
USBF1_TX2_N: CO301.23(B3) D306.1(CH1) ; port USBF1.USBF1_TX2_N
USBF1_TX2_P: CO301.22(B2) D306.2(CH2) ; port USBF1.USBF1_TX2_P
USBF2_5V: C304.1 CO302.4(A4) CO302.9(A9) CO302.24(B4) CO302.29(B9) ; port USBF2.USBF2_5V
USBF2_CC1: CO302.5(A5) ; port USBF2.USBF2_CC
USBF2_CC2: CO302.25(B5) ; port USBF2.USBF2_SBU
USBF2_N: CO302.7(A7) CO302.27(B7) D302.1(D+) ; port USBF2.USBF2_N
USBF2_P: CO302.6(A6) CO302.26(B6) D302.2(D-) ; port USBF2.USBF2_P
USBF2_RX1_N: CO302.30(B10) D307.5(CH4) ; port USBF2.USBF2_RX1_N
USBF2_RX1_P: CO302.31(B11) D307.4(CH3) ; port USBF2.USBF2_RX1_P
USBF2_RX2_N: CO302.10(A10) D308.4(CH3) ; port USBF2.USBF2_RX2_N
USBF2_RX2_P: CO302.11(A11) D308.5(CH4) ; port USBF2.USBF2_RX2_P
USBF2_TX1_N: CO302.3(A3) D307.2(CH2) ; port USBF2.USBF2_TX1_N
USBF2_TX1_P: CO302.2(A2) D307.1(CH1) ; port USBF2.USBF2_TX1_P
USBF2_TX2_N: CO302.23(B3) D308.1(CH1) ; port USBF2.USBF2_TX2_N
USBF2_TX2_P: CO302.22(B2) D308.2(CH2) ; port USBF2.USBF2_TX2_P
USBF3_5V: C301.1 CO303.1(VCC) ; port USBF3.USBF3_5V
USBF3_N: CO303.2(D-) D303.1(D+) ; port USBF3.USBF3_N
USBF3_P: CO303.3(D+) D303.2(D-) ; port USBF3.USBF3_P
USBF3_RX_N: CO303.5(RX-) D309.5(CH4) ; port USBF3.USBF3_RX_N
USBF3_RX_P: CO303.6(RX+) D309.4(CH3) ; port USBF3.USBF3_RX_P
USBF3_TX_N: CO303.8(TX-) D309.2(CH2) ; port USBF3.USBF3_TX_N
USBF3_TX_P: CO303.9(TX+) D309.1(CH1) ; port USBF3.USBF3_TX_P
USBF4_5V: C302.1 CO304.1(VCC) ; port USBF4.USBF4_5V
USBF4_N: CO304.2(D-) D304.1(D+) ; port USBF4.USBF4_N
USBF4_P: CO304.3(D+) D304.2(D-) ; port USBF4.USBF4_P

Not connected (* = marked no-connect by the designer): CO301 8(A8) 28(B8); CO302 8(A8) 28(B8); D305 6(NC) 7(NC) 9(NC) 10(NC); D306 6(NC) 7(NC) 9(NC) 10(NC); D307 6(NC) 7(NC) 9(NC) 10(NC); D308 6(NC) 7(NC) 9(NC) 10(NC); D309 6(NC) 7(NC) 9(NC) 10(NC)

### Layout directives
differential pair; differential pair class USB3: USBF1_N, USBF1_P, USBF1_RX1_N, USBF1_RX1_P, USBF1_RX2_N, USBF1_RX2_P, USBF1_TX1_N, USBF1_TX1_P, USBF1_TX2_N, USBF1_TX2_P, USBF2_N, USBF2_P, USBF2_RX1_N, USBF2_RX1_P, USBF2_RX2_N, USBF2_RX2_P, USBF2_TX1_N, USBF2_TX1_P, USBF2_TX2_N, USBF2_TX2_P, USBF3_N, USBF3_P, USBF3_RX_N, USBF3_RX_P, USBF3_TX_N, USBF3_TX_P, USBF4_N, USBF4_P

### Notes on the sheet
- Title
- Size:
- Date:
- File:
- A2
- Number:
- Time:
- Revision:
- Sheet
- of

### Library data of the parts
C301 C302 = CA0007: 47µF 16V 20% X5R; Part Number: CA0007; ManfactPart: EMK325ABJ476MM8P; ID: 7; RefVal: 47µF
C303 C304 = CA0043: 150µF 50V 20% 363mA; Part Number: CA0043; ManfactPart: 860010675016; ID: 43; RefVal: 150µF
CO301 CO302 = CO0030: as CO101 on sheet 101_Power; RefVal: USB4056; ManfactPart: USB4056-03-A
CO303 = CO0041: USB3.0 Type A receptacle Horizontal; Part Number: CO0041; ID: 41; RefVal: USB1135; ManfactPart: USB1135-15-9-L-B
CO304 = CO0040: USB2.0 Type A receptacle Horizontal; Part Number: CO0040; ID: 40; RefVal: USB1130; ManfactPart: USB1130-15-A
D301-D304 = DI0002: USB 2 TVS Diode; Part Number: DI0002; ManfactPart: TPD2EUSB30DRTR; ID: 2; RefVal: TVS
D305-D309 = DI0007: USB 3 TVS Diode; Part Number: DI0007; ManfactPart: PUSB3FA2Z; ID: 7; RefVal: TVS

## Sheet 401_RPi0.SchDoc: RPi Zero Wireless
size A2; Organization: Greenfield Tech Solutions; Address1: Molendreef 33; Address2: Ossendrecht; Address3: 4641CS; Address4: The Netherlands; DocumentNumber: P234; Revision: 3.0; SheetNumber: 5; SheetTotal: 8
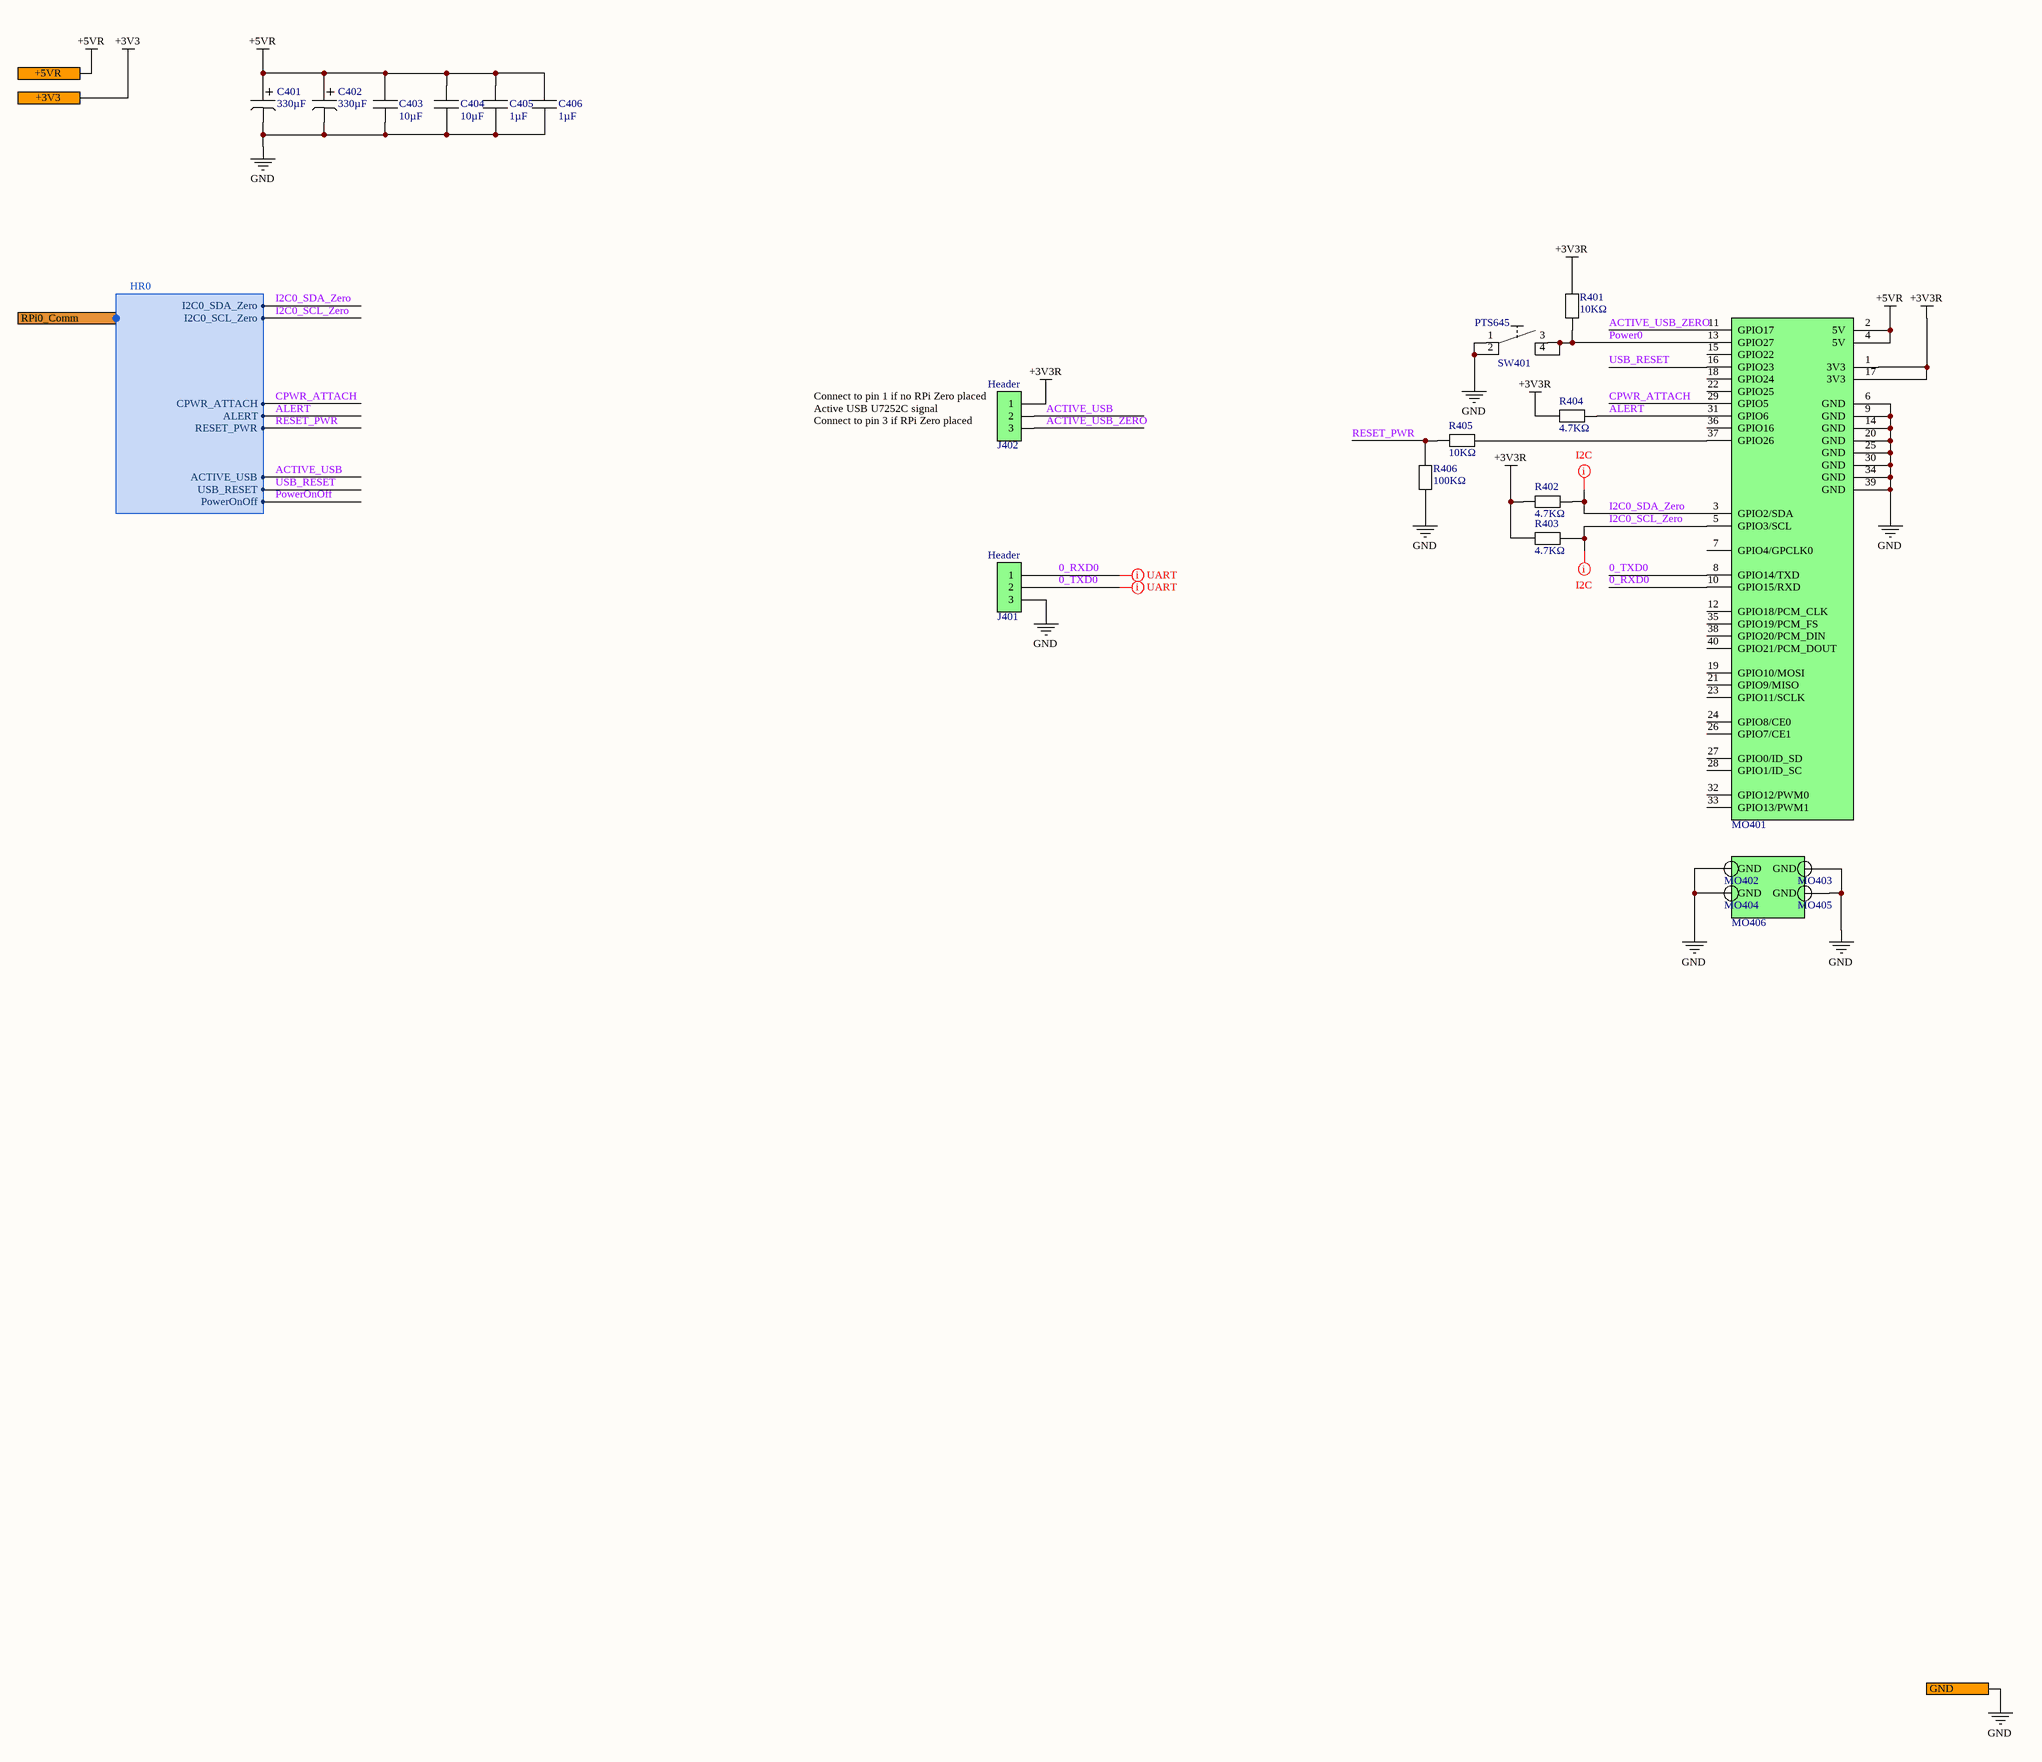
[diagram p5: 401_RPi0.SchDoc]

### Parts
C401  330µF  [EC_E7]
C402  330µF  [EC_E7]
C403  10µF  [C0805]
C404  10µF  [C0805]
C405  1µF  [C0603]
C406  1µF  [C0603]
J401  Header  [1X3P_2.54mm]
J402  Header  [1X3P_2.54mm]
MO401  ZeroW-1  [RPIZeroW_HeaderPins]  (value not drawn)
MO402  ZeroW-M  [CM4-M]  (value not drawn)
MO403  ZeroW-M  [CM4-M]  (value not drawn)
MO404  ZeroW-M  [CM4-M]  (value not drawn)
MO405  ZeroW-M  [CM4-M]  (value not drawn)
MO406  ZeroW  [RPIZeroW_Layout_Heightened]  (value not drawn)
R401  10KΩ  [R0402]
R402  4.7KΩ  [R0603]
R403  4.7KΩ  [R0603]
R404  4.7KΩ  [R0603]
R405  10KΩ  [R0402]
R406  100KΩ  [R0402]
SW401  PTS645  [PTS645-V]

### Ports
+3V3, +5VR, GND, RPi0_Comm (harness HR0)

### Harnesses
HR0: I2C0_SCL_Zero, I2C0_SDA_Zero, CPWR_ATTACH, PowerOnOff, USB_RESET, ACTIVE_USB, ALERT, RESET_PWR

### Nets
+3V3R: J402.1 MO401.1(3V3) MO401.17(3V3) R401.2 R402.1 R403.1 R404.1
+5VR: C401.1 C402.1 C403.1 C404.1 C405.1 C406.1 MO401.2(5V) MO401.4(5V) ; port +5VR
GND: C401.2 C402.2 C403.2 C404.2 C405.2 C406.2 J401.3 MO401.6(GND) MO401.9(GND) MO401.14(GND) MO401.20(GND) MO401.25(GND) MO401.30(GND) MO401.34(GND) MO401.39(GND) MO402.GND MO403.GND MO404.GND MO405.GND R406.1 SW401.1 SW401.2 ; port GND
0_RXD0: J401.1 MO401.10(GPIO15/RXD)
0_TXD0: J401.2 MO401.8(GPIO14/TXD)
ACTIVE_USB: J402.2 ; port RPi0_Comm.ACTIVE_USB
ACTIVE_USB_ZERO: J402.3 MO401.11(GPIO17)
ALERT: MO401.31(GPIO6) R404.2 ; port RPi0_Comm.ALERT
CPWR_ATTACH: MO401.29(GPIO5) ; port RPi0_Comm.CPWR_ATTACH
I2C0_SCL_Zero: MO401.5(GPIO3/SCL) R403.2 ; port RPi0_Comm.I2C0_SCL_Zero
I2C0_SDA_Zero: MO401.3(GPIO2/SDA) R402.2 ; port RPi0_Comm.I2C0_SDA_Zero
Power0: MO401.13(GPIO27) R401.1 SW401.3 SW401.4
PowerOnOff: port RPi0_Comm.PowerOnOff
RESET_PWR: R405.1 R406.2 ; port RPi0_Comm.RESET_PWR
USB_RESET: MO401.16(GPIO23) ; port RPi0_Comm.USB_RESET
NetMO401_37: MO401.37(GPIO26) R405.2

Not connected (* = marked no-connect by the designer): MO401 7(GPIO4/GPCLK0) 12(GPIO18/PCM_CLK) 15(GPIO22) 18(GPIO24) 19(GPIO10/MOSI) 21(GPIO9/MISO) 22(GPIO25) 23(GPIO11/SCLK) 24(GPIO8/CE0) 26(GPIO7/CE1) 27(GPIO0/ID_SD) 28(GPIO1/ID_SC) 32(GPIO12/PWM0) 33(GPIO13/PWM1) 35(GPIO19/PCM_FS) 36(GPIO16) 38(GPIO20/PCM_DIN) 40(GPIO21/PCM_DOUT)

### Layout directives
net class I2C_0: I2C0_SCL_Zero, I2C0_SDA_Zero
net class UART_0: 0_RXD0, 0_TXD0

### Notes on the sheet
- (near J402) Connect to pin 1 if no RPi Zero placed
- Active USB U7252C signal
- (near J402) Connect to pin 3 if RPi Zero placed
- Title
- Size:
- Date:
- File:
- A2
- Number:
- Time:
- Revision:
- Sheet
- of

### Library data of the parts
C401 C402 = CA0012: 330µF 16V 20% 16mΩ 4100mA; Part Number: CA0012; ManfactPart: 16SVPG330MX; ID: 12; RefVal: 330µF
C403 C404 = CA0001: as C102 on sheet 101_Power; RefVal: 10µF
C405 C406 = CA0003: as C144 on sheet 101_Power; RefVal: 1µF
J401 J402 = CO0018: Header 1x3P; Part Number: CO0018; ManfactPart: G800W305018EU; ID: 32; RefVal: Header
MO401 = MO0017: RPI ZeroW Header 1-40; Part Number: MO0017; ManfactPart: 9900002236265; ID: 17; RefVal: ZeroW-1
MO402-MO405 = MO0016: RPI ZeroW Mounting Studs; Part Number: MO0016; ManfactPart: 9774030151R; ID: 16; RefVal: ZeroW-M
MO406 = MO0022: Outline of ZeroW Heigthened P\lacement; Part Number: MO0022; ManfactPart: RPI Zero W; ID: 22; RefVal: ZeroW
R401 R405 = RS0011: as R125 on sheet 101_Power; RefVal: 10KΩ
R402-R404 = RS0002: 4.7KΩ 1% 100mW; Part Number: RS0002; ManfactPart: WR06X4701FTL; ID: 2; RefVal: 4.7KΩ
R406 = RS0036: as R111 on sheet 101_Power; RefVal: 100KΩ
SW401 = SW0003: TACTILE SWITCH SPST; Part Number: SW0003; ManfactPart: PTS645VK832LFS; ID: 3; RefVal: PTS645

## Sheet 501_RPiCM4.SchDoc: RPi Compute Module 4
size A2; Organization: Greenfield Tech Solutions; Address1: Molendreef 33; Address2: Ossendrecht; Address3: 4641CS; Address4: The Netherlands; DocumentNumber: P234; Revision: 3.0; SheetNumber: 6; SheetTotal: 8
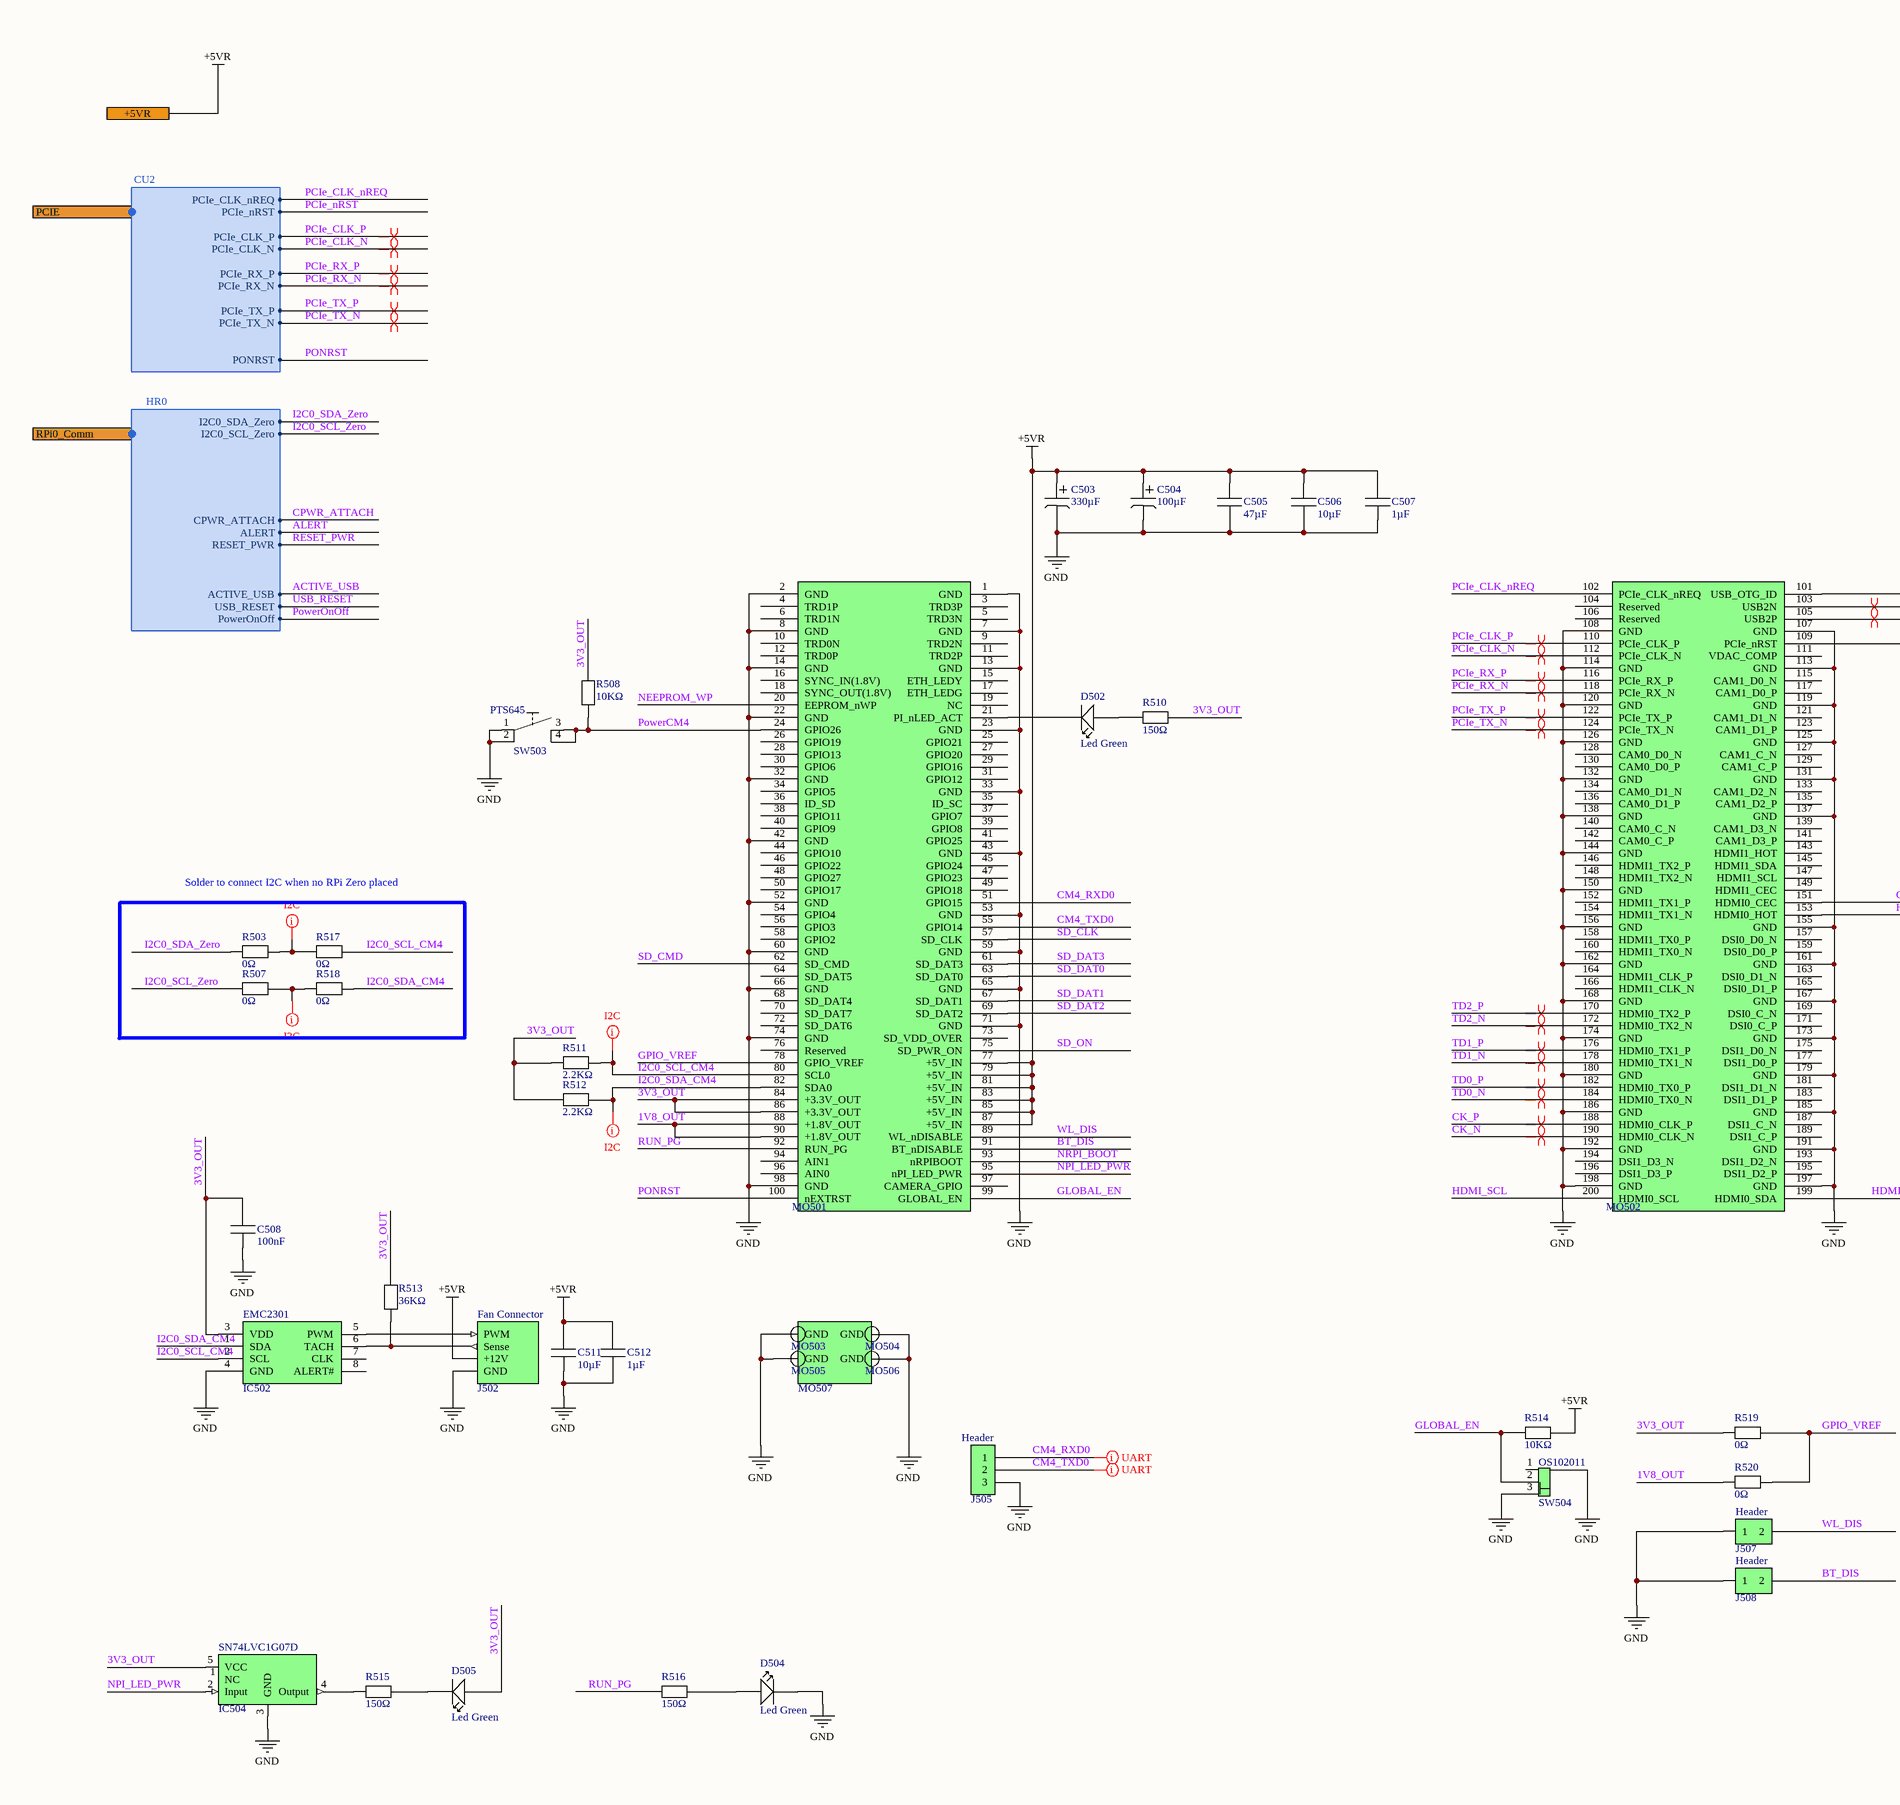
[diagram p6: 501_RPiCM4.SchDoc, left]
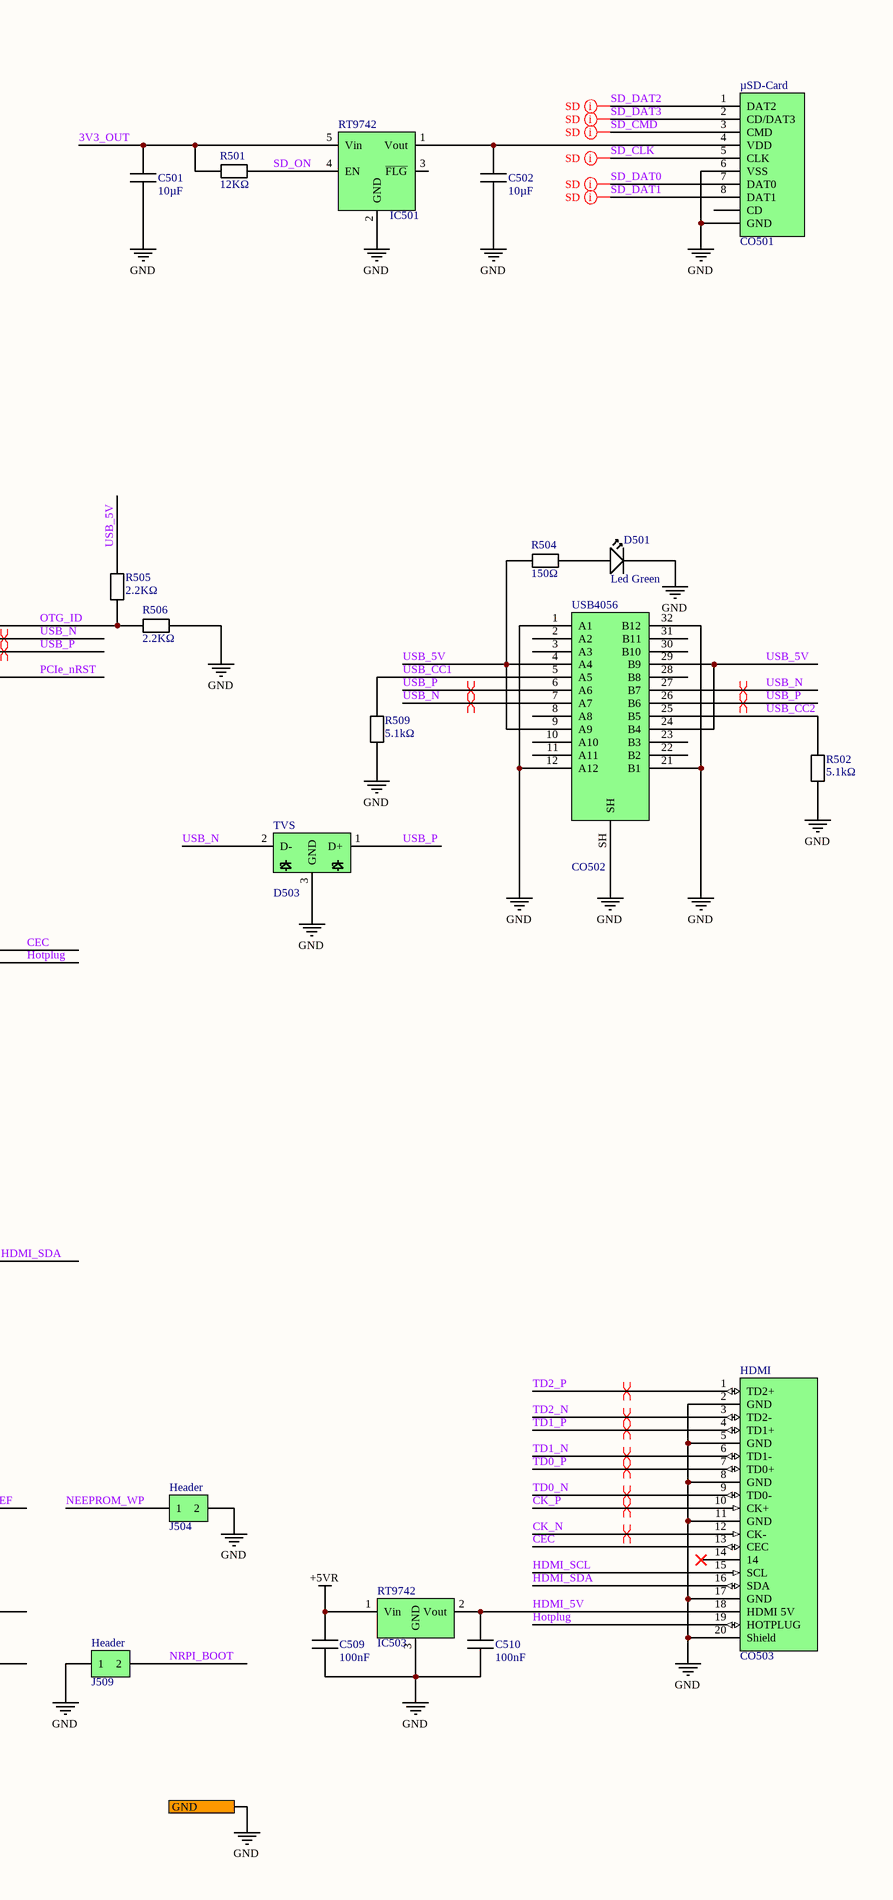
[diagram p7: 501_RPiCM4.SchDoc, right]

### Parts
C501  10µF  [C0603]
C502  10µF  [C0603]
C503  330µF  [EC_E7]
C504  100µF  [EC_B6]
C505  47µF  [C1210]
C506  10µF  [C0603]
C507  1µF  [C0603]
C508  100nF  [C0402]
C509  100nF  [C0402]
C510  100nF  [C0402]
C511  10µF  [C0603]
C512  1µF  [C0603]
CO501  µSD-Card  [693071030811]
CO502  USB4056  [USB4056-03-A]
CO503  HDMI  [HDMI]
D501  Led Green  [Led0805]
D502  Led Green  [Led0805]
D503  TVS  [SOT-3]
D504  Led Green  [Led0805]
D505  Led Green  [Led0805]
IC501  RT9742  [SOT-23-5]
IC502  EMC2301  [MSOP-8_3X3]
IC503  RT9742  [SOT-23]
IC504  SN74LVC1G07D  [SOT-23-5]
J502  Fan Connector  [470531000]
J504  Header  [1X2P_2.54mm]
J505  Header  [1X3P_2.54mm]
J507  Header  [1X2P_2.54mm]
J508  Header  [1X2P_2.54mm]
J509  Header  [1X2P_2.54mm]
MO501  CM4-1  [CM4_001-100]  (value not drawn)
MO502  CM4-2  [CM4_101-200]  (value not drawn)
MO503  CM4-M  [CM4-M]  (value not drawn)
MO504  CM4-M  [CM4-M]  (value not drawn)
MO505  CM4-M  [CM4-M]  (value not drawn)
MO506  CM4-M  [CM4-M]  (value not drawn)
MO507  CM4  [RPICM4_Layout]  (value not drawn)
R501  12KΩ  [R0402]
R502  5.1kΩ  [R0402]
R503  0Ω  [R0402]
R504  150Ω  [R0603]
R505  2.2KΩ  [R0402]
R506  2.2KΩ  [R0402]
R507  0Ω  [R0402]
R508  10KΩ  [R0402]
R509  5.1kΩ  [R0402]
R510  150Ω  [R0603]
R511  2.2KΩ  [R0402]
R512  2.2KΩ  [R0402]
R513  36KΩ  [R0402]
R514  10KΩ  [R0603]
R515  150Ω  [R0603]
R516  150Ω  [R0603]
R517  0Ω  [R0402]
R518  0Ω  [R0402]
R519  0Ω  [R0402]
R520  0Ω  [R0402]
SW503  PTS645  [PTS645-V]
SW504  OS102011  [OS10_Series]

### Blocks framed on the sheet
Solder to connect I2C when no RPi Zero placed: R503 R507 R517 R518

### Ports
+5VR, GND, PCIE (harness CU2), RPi0_Comm (harness HR0)

### Harnesses
CU2: PCIe_nRST, PCIe_CLK_nREQ, PCIe_CLK_N, PCIe_CLK_P, PCIe_RX_N, PCIe_RX_P, PCIe_TX_N, PCIe_TX_P, PONRST
HR0: I2C0_SCL_Zero, I2C0_SDA_Zero, CPWR_ATTACH, PowerOnOff, USB_RESET, ACTIVE_USB, ALERT, RESET_PWR

### Nets
+5VR: C503.1 C504.1 C505.1 C506.1 C507.1 C509.1 C511.1 C512.1 IC503.1(Vin) J502.3(+12V) MO501.77(+5V_IN) MO501.79(+5V_IN) MO501.81(+5V_IN) MO501.83(+5V_IN) MO501.85(+5V_IN) MO501.87(+5V_IN) R514.2 ; port +5VR
GND: C501.2 C502.2 C503.2 C504.2 C505.2 C506.2 C507.2 C508.2 C509.2 C510.2 C511.2 C512.2 CO501.6(VSS) CO501.GND CO502.1(A1) CO502.12(A12) CO502.21(B1) CO502.32(B12) CO502.SH CO503.2(GND) CO503.5(GND) CO503.8(GND) CO503.11(GND) CO503.17(GND) CO503.20(Shield) D501.K D503.3(GND) D504.K IC501.2(GND) IC502.4(GND) IC503.3(GND) IC504.3(GND) J502.4(GND) J504.2 J505.3 J507.1 J508.1 J509.1 MO501.1(GND) MO501.2(GND) MO501.7(GND) MO501.8(GND) MO501.13(GND) MO501.14(GND) MO501.22(GND) MO501.23(GND) MO501.32(GND) MO501.33(GND) MO501.42(GND) MO501.43(GND) MO501.52(GND) MO501.53(GND) MO501.59(GND) MO501.60(GND) MO501.65(GND) MO501.66(GND) MO501.71(GND) MO501.74(GND) MO501.98(GND) MO502.107(GND) MO502.108(GND) MO502.113(GND) MO502.114(GND) MO502.119(GND) MO502.120(GND) MO502.125(GND) MO502.126(GND) MO502.131(GND) MO502.132(GND) MO502.137(GND) MO502.138(GND) MO502.144(GND) MO502.150(GND) MO502.155(GND) MO502.156(GND) MO502.161(GND) MO502.162(GND) MO502.167(GND) MO502.168(GND) MO502.173(GND) MO502.174(GND) MO502.179(GND) MO502.180(GND) MO502.185(GND) MO502.186(GND) MO502.191(GND) MO502.192(GND) MO502.197(GND) MO502.198(GND) MO503.GND MO504.GND MO505.GND MO506.GND R502.1 R506.1 R509.1 SW503.1 SW503.2 SW504.3 SW504.GND ; port GND
1V8_OUT: MO501.88(+1.8V_OUT) MO501.90(+1.8V_OUT) R520.1
3V3_OUT: C501.1 C508.1 D505.A IC501.5(Vin) IC502.3(VDD) IC504.5(VCC) MO501.84(+3.3V_OUT) MO501.86(+3.3V_OUT) R501.1 R508.2 R510.2 R511.1 R512.1 R513.2 R519.1
BT_DIS: J508.2 MO501.91(BT_nDISABLE)
CEC: CO503.13(CEC) MO502.151(HDMI0_CEC)
CK_N: CO503.12(CK-) MO502.190(HDMI0_CLK_N)
CK_P: CO503.10(CK+) MO502.188(HDMI0_CLK_P)
CM4_RXD0: J505.1 MO501.51(GPIO15)
CM4_TXD0: J505.2 MO501.55(GPIO14)
GLOBAL_EN: MO501.99(GLOBAL_EN) R514.1 SW504.2
GPIO_VREF: MO501.78(GPIO_VREF) R519.2 R520.2
HDMI_5V: C510.1 CO503.18(HDMI_5V) IC503.2(Vout)
HDMI_SCL: CO503.15(SCL) MO502.200(HDMI0_SCL)
HDMI_SDA: CO503.16(SDA) MO502.199(HDMI0_SDA)
Hotplug: CO503.19(HOTPLUG) MO502.153(HDMI0_HOT)
I2C0_SCL_CM4: IC502.2(SCL) MO501.80(SCL0) R511.2 R517.2
I2C0_SCL_Zero: R507.1 ; port RPi0_Comm.I2C0_SCL_Zero
I2C0_SDA_CM4: IC502.1(SDA) MO501.82(SDA0) R512.2 R518.2
I2C0_SDA_Zero: R503.1 ; port RPi0_Comm.I2C0_SDA_Zero
NEEPROM_WP: J504.1 MO501.20(EEPROM_nWP)
NPI_LED_PWR: IC504.2(Input) MO501.95(nPI_LED_PWR)
NRPI_BOOT: J509.2 MO501.93(nRPIBOOT)
OTG_ID: MO502.101(USB_OTG_ID) R505.1 R506.2
PCIe_CLK_N: MO502.112(PCIe_CLK_N) ; port PCIE.PCIe_CLK_N
PCIe_CLK_nREQ: MO502.102(PCIe_CLK_nREQ) ; port PCIE.PCIe_CLK_nREQ
PCIe_CLK_P: MO502.110(PCIe_CLK_P) ; port PCIE.PCIe_CLK_P
PCIe_nRST: MO502.109(PCIe_nRST) ; port PCIE.PCIe_nRST
PCIe_RX_N: MO502.118(PCIe_RX_N) ; port PCIE.PCIe_RX_N
PCIe_RX_P: MO502.116(PCIe_RX_P) ; port PCIE.PCIe_RX_P
PCIe_TX_N: MO502.124(PCIe_TX_N) ; port PCIE.PCIe_TX_N
PCIe_TX_P: MO502.122(PCIe_TX_P) ; port PCIE.PCIe_TX_P
PONRST: MO501.100(nEXTRST) ; port PCIE.PONRST
PowerCM4: MO501.24(GPIO26) R508.1 SW503.3 SW503.4
PowerOnOff: port RPi0_Comm.PowerOnOff
RUN_PG: MO501.92(RUN_PG) R516.1
SD_CLK: CO501.5(CLK) MO501.57(SD_CLK)
SD_CMD: CO501.3(CMD) MO501.62(SD_CMD)
SD_DAT0: CO501.7(DAT0) MO501.63(SD_DAT0)
SD_DAT1: CO501.8(DAT1) MO501.67(SD_DAT1)
SD_DAT2: CO501.1(DAT2) MO501.69(SD_DAT2)
SD_DAT3: CO501.2(CD/DAT3) MO501.61(SD_DAT3)
SD_ON: IC501.4(EN) MO501.75(SD_PWR_ON) R501.2
TD0_N: CO503.9(TD0-) MO502.184(HDMI0_TX0_N)
TD0_P: CO503.7(TD0+) MO502.182(HDMI0_TX0_P)
TD1_N: CO503.6(TD1-) MO502.178(HDMI0_TX1_N)
TD1_P: CO503.4(TD1+) MO502.176(HDMI0_TX1_P)
TD2_N: CO503.3(TD2-) MO502.172(HDMI0_TX2_N)
TD2_P: CO503.1(TD2+) MO502.170(HDMI0_TX2_P)
USB_5V: CO502.4(A4) CO502.9(A9) CO502.24(B4) CO502.29(B9) R504.1 R505.2
USB_CC1: CO502.5(A5) R509.2
USB_CC2: CO502.25(B5) R502.2
USB_N: CO502.7(A7) CO502.27(B7) D503.2(D-) MO502.103(USB2N)
USB_P: CO502.6(A6) CO502.26(B6) D503.1(D+) MO502.105(USB2P)
WL_DIS: J507.2 MO501.89(WL_nDISABLE)
NetC502_1: C502.1 CO501.4(VDD) IC501.1(Vout)
NetD501_A: D501.A R504.2
NetD502_A: D502.A R510.1
NetD502_K: D502.K MO501.21(PI_nLED_ACT)
NetD504_A: D504.A R516.2
NetD505_K: D505.K R515.2
NetIC502_5: IC502.5(PWM) J502.1(PWM)
NetIC502_6: IC502.6(TACH) J502.2(Sense) R513.1
NetIC504_4: IC504.4(Output) R515.1
NetR503_2: R503.2 R517.1
NetR507_2: R507.2 R518.1

Not connected (* = marked no-connect by the designer): CO501 CD; CO502 2(A2) 3(A3) 8(A8) 10(A10) 11(A11) 22(B2) 23(B3) 28(B8) 30(B10) 31(B11); CO503 14*; IC501 3(~{FLG}); IC502 7(CLK) 8(ALERT#); IC504 1(NC); MO501 3(TRD3P) 4(TRD1P) 5(TRD3N) 6(TRD1N) 9(TRD2N) 10(TRD0N) 11(TRD2P) 12(TRD0P) 15(ETH_LEDY) 16(SYNC_IN(1.8V)) 17(ETH_LEDG) 18(SYNC_OUT(1.8V)) 19(NC) 25(GPIO21) 26(GPIO19) 27(GPIO20) 28(GPIO13) 29(GPIO16) 30(GPIO6) 31(GPIO12) 34(GPIO5) 35(ID_SC) 36(ID_SD) 37(GPIO7) 38(GPIO11) 39(GPIO8) 40(GPIO9) 41(GPIO25) 44(GPIO10) 45(GPIO24) 46(GPIO22) 47(GPIO23) 48(GPIO27) 49(GPIO18) 50(GPIO17) 54(GPIO4) 56(GPIO3) 58(GPIO2) 64(SD_DAT5) 68(SD_DAT4) 70(SD_DAT7) 72(SD_DAT6) 73(SD_VDD_OVER) 76(Reserved) 94(AIN1) 96(AIN0) 97(CAMERA_GPIO); MO502 104(Reserved) 106(Reserved) 111(VDAC_COMP) 115(CAM1_D0_N) 117(CAM1_D0_P) 121(CAM1_D1_N) 123(CAM1_D1_P) 127(CAM1_C_N) 128(CAM0_D0_N) 129(CAM1_C_P) 130(CAM0_D0_P) 133(CAM1_D2_N) 134(CAM0_D1_N) 135(CAM1_D2_P) 136(CAM0_D1_P) 139(CAM1_D3_N) 140(CAM0_C_N) 141(CAM1_D3_P) 142(CAM0_C_P) 143(HDMI1_HOT) 145(HDMI1_SDA) 146(HDMI1_TX2_P) 147(HDMI1_SCL) 148(HDMI1_TX2_N) 149(HDMI1_CEC) 152(HDMI1_TX1_P) 154(HDMI1_TX1_N) 157(DSI0_D0_N) 158(HDMI1_TX0_P) 159(DSI0_D0_P) 160(HDMI1_TX0_N) 163(DSI0_D1_N) 164(HDMI1_CLK_P) 165(DSI0_D1_P) 166(HDMI1_CLK_N) 169(DSI0_C_N) 171(DSI0_C_P) 175(DSI1_D0_N) 177(DSI1_D0_P) 181(DSI1_D1_N) 183(DSI1_D1_P) 187(DSI1_C_N) 189(DSI1_C_P) 193(DSI1_D2_N) 194(DSI1_D3_N) 195(DSI1_D2_P) 196(DSI1_D3_P); SW504 1

### Layout directives
differential pair; differential pair class HDMI: CK_N, CK_P, TD0_N, TD0_P, TD1_N, TD1_P, TD2_N, TD2_P
differential pair; differential pair class USB3: USB_N, USB_P
net class SD_CM4: SD_CLK, SD_CMD, SD_DAT0, SD_DAT1, SD_DAT2, SD_DAT3
differential pair; differential pair class PCIE: PCIe_CLK_N, PCIe_CLK_P, PCIe_RX_N, PCIe_RX_P, PCIe_TX_N, PCIe_TX_P
net class UART_CM4: CM4_RXD0, CM4_TXD0
net class I2C_CM4: I2C0_SCL_CM4, I2C0_SDA_CM4
net class I2C_COM: NetR503_2, NetR507_2

### Notes on the sheet
- Title
- Size:
- Date:
- File:
- A2
- Number:
- Time:
- Revision:
- Sheet
- of

### Library data of the parts
C501 C502 C506 C511 = CA0008: as C133 on sheet 101_Power; RefVal: 10µF
C503 = CA0012: as C401 on sheet 401_RPi0; RefVal: 330µF
C504 = CA0011: 100µF 16V 20% 15mΩ 4000mA; Part Number: CA0011; ManfactPart: 16SVPG100M; ID: 11; RefVal: 100µF
C505 = CA0007: as C301 on sheet 301_FrameUSB; RefVal: 47µF
C507 C512 = CA0003: as C144 on sheet 101_Power; RefVal: 1µF
C508-C510 = CA0010: 100nF 16V 10% X7R; Part Number: CA0010; ManfactPart: GCM155R71C104KA55D; ID: 10; RefVal: 100nF
CO501 = CO0027: µSD-Card holder; Part Number: CO0027; ID: 24; RefVal: µSD-Card; ManfactPart: 693071030811
CO502 = CO0030: as CO101 on sheet 101_Power; RefVal: USB4056; ManfactPart: USB4056-03-A
CO503 = CO0007: Part Number: CO0007; ManfactPart: 10029449; ID: 7; RefVal: HDMI
D501 D502 D504 D505 = DI0001: as D103 on sheet 101_Power; RefVal: Led Green
D503 = DI0002: as D301 on sheet 301_FrameUSB; RefVal: TVS
IC501 = IC0029: RT9742 High side power switch; Part Number: IC0029; ManfactPart: RT9742GGJ5; ID: 29; RefVal: RT9742
IC502 = IC0054: Board Mount Temperature Sensors Single RPB-Based PWM Fan Speed CNTRL; Part Number: IC0054; ManfactPart: EMC2301-1-ACZL-TR; ID: 54; RefVal: EMC2301
IC503 = IC0011: RT9742SNGV; Part Number: IC0011; ID: 11; RefVal: RT9742; ManfactPart: RT9742SNGV
IC504 = IC0009: Buffer IC; Part Number: IC0009; ManfactPart: SN74LVC1G07DBVT; ID: 9; RefVal: SN74LVC1G07D
J502 = CO0010: Fan Connector 4pin; Part Number: CO0010; ID: 10; RefVal: Fan Connector; ManfactPart: 470531000
J504 J507-J509 = CO0012: as J102 on sheet 101_Power; RefVal: Header
J505 = CO0018: as J401 on sheet 401_RPi0; RefVal: Header
MO501 = MO0012: RPI CM4 Pin 1-100; Part Number: MO0012; ManfactPart: DF40HC(3.0)-100DS-0.4V; ID: 12; RefVal: CM4-1
MO502 = MO0013: RPI CM4 Pin 101-200; Part Number: MO0013; ManfactPart: DF40HC(3.0)-100DS-0.4V; ID: 13; RefVal: CM4-2
MO503-MO506 = MO0014: RPI CM4 Mounting Studs; Part Number: MO0014; ManfactPart: 9774030151R; ID: 14; RefVal: CM4-M
MO507 = MO0011: Outline of CM4; Part Number: MO0011; ManfactPart: RPI CM4; ID: 11; RefVal: CM4
R501 = RS0015: as R102 on sheet 101_Power; RefVal: 12KΩ
R502 R509 = RS0038: 5.1KΩ 1% 62.5mW 100PPM; Part Number: RS0038; ManfactPart: CRCW04025K10FKEDC; ID: 38; RefVal: 5.1kΩ
R503 R507 R517-R520 = RS0074: 0Ω 62.5mW; Part Number: RS0074; ManfactPart: 0402WGJ0000TCE; ID: 74; RefVal: 0Ω
R504 R510 R515 R516 = RS0001: as R129 on sheet 101_Power; RefVal: 150Ω
R505 R506 R511 R512 = RS0020: 2.2KΩ 5% 62.5mW; Part Number: RS0020; ManfactPart: MCMR04X222 JTL; ID: 20; RefVal: 2.2KΩ
R508 = RS0011: as R125 on sheet 101_Power; RefVal: 10KΩ
R513 = RS0051: 36KΩ 1% 62.5mW 100PPM; Part Number: RS0051; ManfactPart: ERJ-2RKF3602X; ID: 51; RefVal: 36KΩ
R514 = RS0003: 10KΩ 5% 100mW; Part Number: RS0003; ManfactPart: WR06X103 JTL; ID: 3; RefVal: 10KΩ
SW503 = SW0003: as SW401 on sheet 401_RPi0; RefVal: PTS645
SW504 = SW0001: Miniature Slide Switch SPDT; Part Number: SW0001; ManfactPart: OS102011MS2QN1; ID: 1; RefVal: OS102011